# EAGLE schematic S140032_EMS_10HP_DS (EAGLE 6.5.0)

## Sheet 1 of 8: Backplane Layout
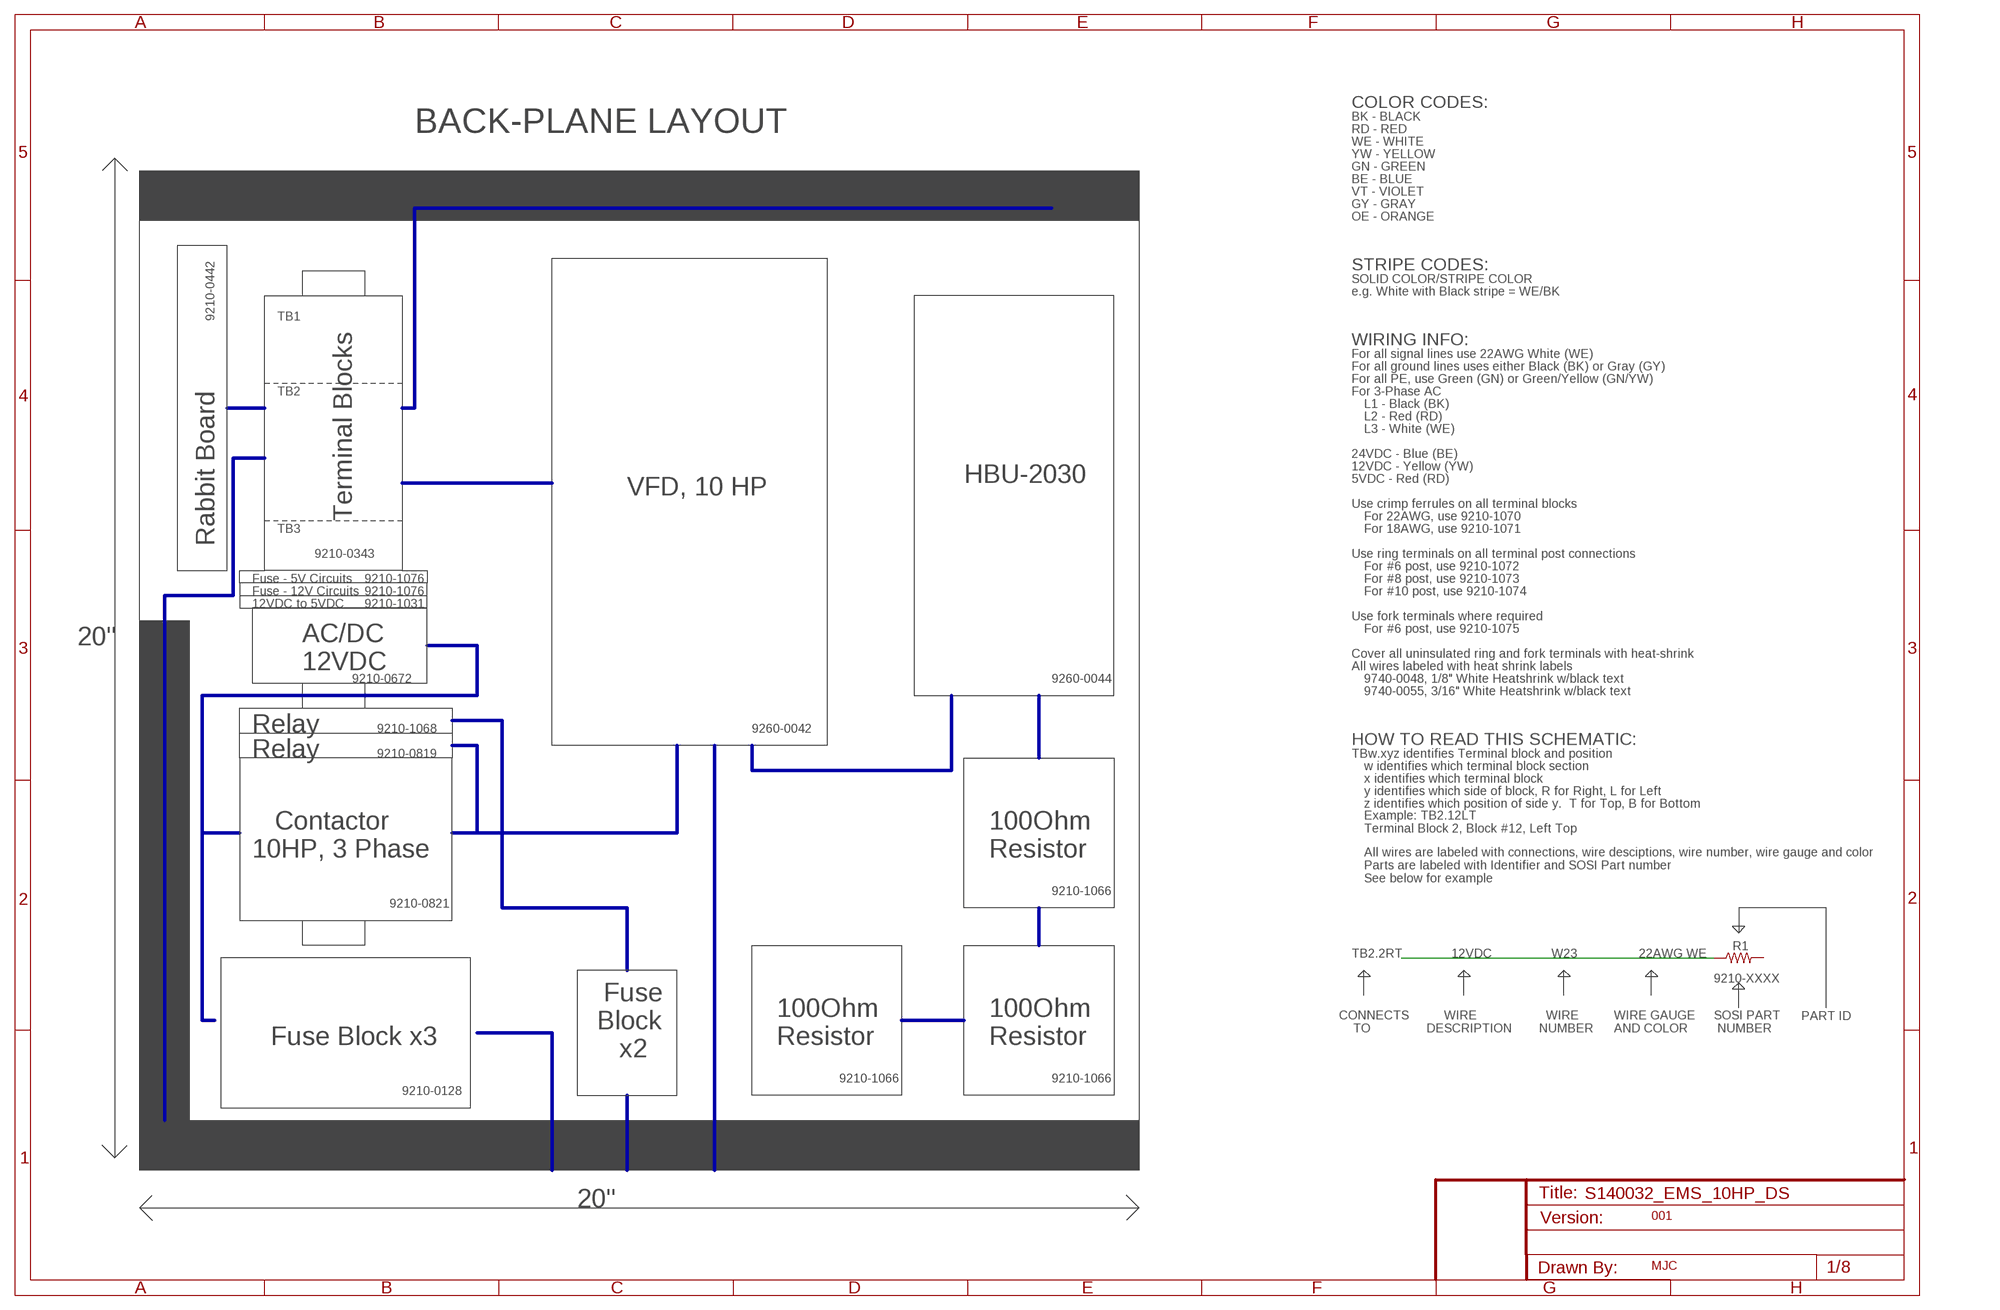
[diagram p0: schematic, sheet 1]

### Parts
R1  R-US_0204/2V  [0204V]

### Nets
12VDC: R1.1 ; also sheet 2,4,6,7,8
Unconnected: R1.2

### Buses
B$1
B$2
B$3
B$4
B$5
B$6
B$7
B$8
B$9
B$10
B$11
B$12
B$13
B$14

### Notes on the sheet
- COLOR CODES:
- BK - BLACK
- BACK-PLANE LAYOUT | RD - RED
- WE - WHITE
- YW - YELLOW
- GN - GREEN
- BE - BLUE
- VT - VIOLET
- GY - GRAY
- OE - ORANGE
- STRIPE CODES:
- SOLID COLOR/STRIPE COLOR
- e.g. White with Black stripe = WE/BK
- 9210-0442 | TB1
- WIRING INFO:
- For all signal lines use 22AWG White (WE)
- For all ground lines uses either Black (BK) or Gray (GY)
- For all PE, use Green (GN) or Green/Yellow (GN/YW)
- TB2 | For 3-Phase AC
- L1 - Black (BK)
- L2 - Red (RD)
- L3 - White (WE)
- 24VDC - Blue (BE)
- 12VDC - Yellow (YW)
- HBU-2030 | 5VDC - Red (RD)
- VFD, 10 HP
- Use crimp ferrules on all terminal blocks
- Terminal Blocks | For 22AWG, use 9210-1070
- TB3 | For 18AWG, use 9210-1071
- Rabbit Board
- 9210-0343 | Use ring terminals on all terminal post connections
- For #6 post, use 9210-1072
- Fuse - 5V Circuits | 9210-1076 | For #8 post, use 9210-1073
- Fuse - 12V Circuits | 9210-1076 | For #10 post, use 9210-1074
- 12VDC to 5VDC | 9210-1031
- Use fork terminals where required
- For #6 post, use 9210-1075
- 20"
- Cover all uninsulated ring and fork terminals with heat-shrink
- AC/DC 
  12VDC
- All wires labeled with heat shrink labels
- 9210-0672 | 9260-0044 | 9740-0048, 1/8" White Heatshrink w/black text
- 9740-0055, 3/16" White Heatshrink w/black text
- Relay | 9210-1068 | 9260-0042
- HOW TO READ THIS SCHEMATIC:
- Relay | 9210-0819 | TBw.xyz identifies Terminal block and position
- w identifies which terminal block section
- x identifies which terminal block
- y identifies which side of block, R for Right, L for Left
- z identifies which position of side y.  T for Top, B for Bottom
- Example: TB2.12LT
  Terminal Block 2, Block #12, Left Top
- Contactor
  10HP, 3 Phase
- 100Ohm
  Resistor
- All wires are labeled with connections, wire desciptions, wire number, wire gauge and color
  Parts are labeled with Identifier and SOSI Part number
  See below for example
- 9210-1066
- 9210-0821
- TB2.2RT | W23 | 22AWG WE
- 9210-XXXX
- PART ID
- CONNECTS
      TO
- WIRE 
  DESCRIPTION
- WIRE 
  NUMBER
- WIRE GAUGE
  AND COLOR
- SOSI PART
   NUMBER
- Fuse Block x3
- 100Ohm
  Resistor
- 100Ohm
  Resistor
- Fuse
  Block 
  x2
- 9210-1066 | 9210-1066
- 9210-0128
- 20"
- 001
- MJC

## Sheet 2 of 8: Terminal Blocks
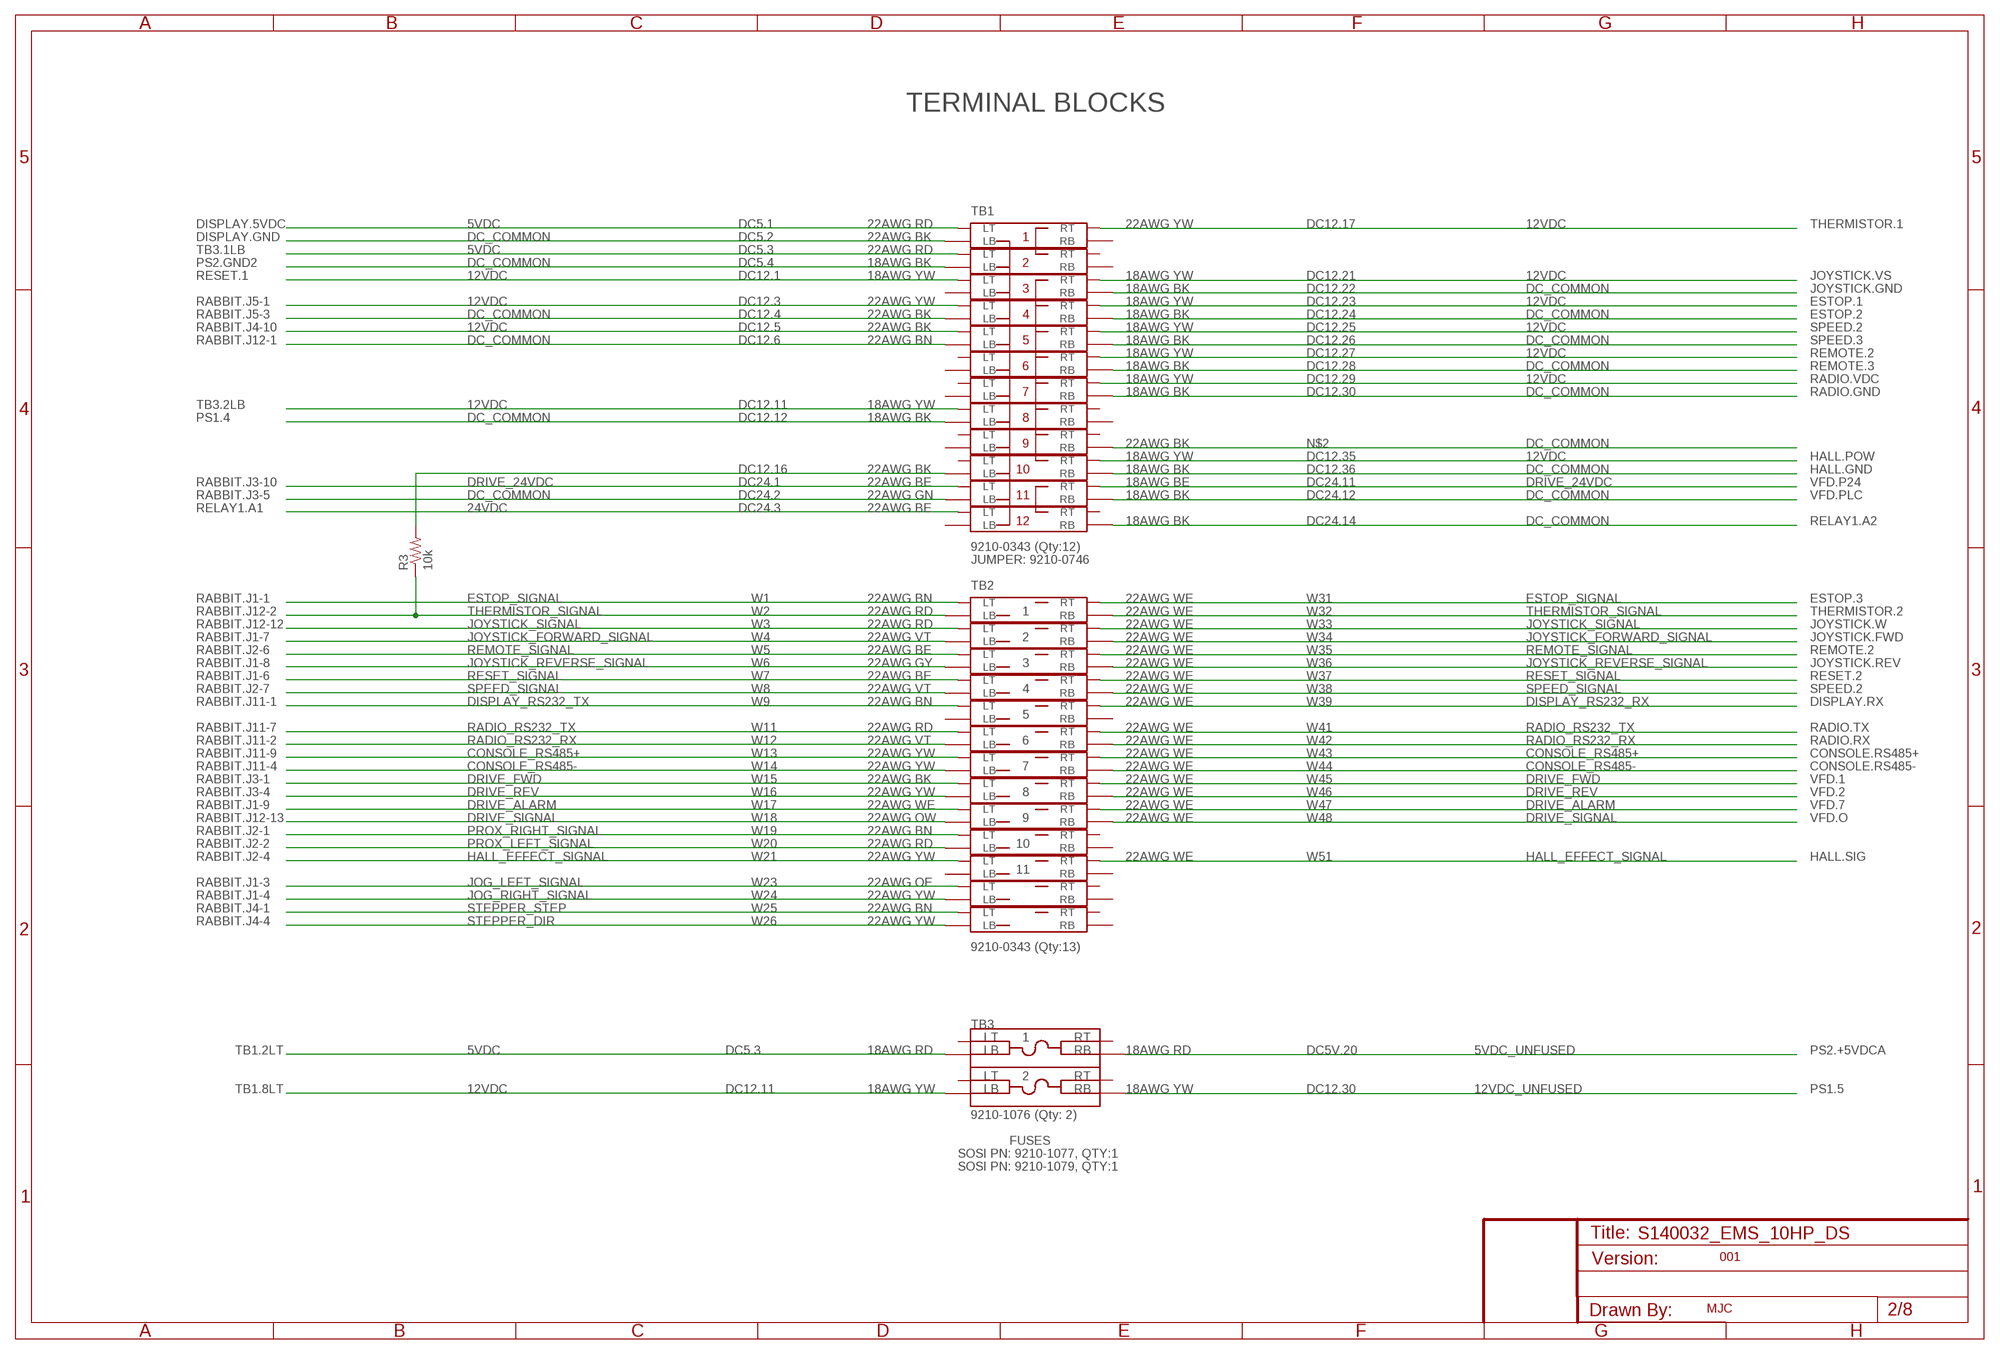
[diagram p1: schematic, sheet 2]

### Parts
R3  10k  R-US_0204/2V  [0204V]
U$1  TB_3031160_1POS  [BOGUS]
U$2  TB_3031160_1POS  [BOGUS]
U$4  TB_3031160_1POS  [BOGUS]
U$7  TB_3031160_1POS  [BOGUS]
U$8  TB_3031160_1POS  [BOGUS]
U$9  TB_FUSE_DDFL4ULR  [BOGUS]
U$10  TB_FUSE_DDFL4ULR  [BOGUS]
U$16  TB_3031160_1POS  [BOGUS]
U$17  TB_3031160_1POS  [BOGUS]
U$18  TB_3031160_1POS  [BOGUS]
U$19  TB_3031160_1POS  [BOGUS]
U$20  TB_3031160_1POS  [BOGUS]
U$21  TB_3031160_1POS  [BOGUS]
U$22  TB_3031160_1POS  [BOGUS]
U$23  TB_3031160_1POS  [BOGUS]
U$24  TB_3031160_1POS  [BOGUS]
U$25  TB_3031160_1POS  [BOGUS]
U$26  TB_3031160_1POS  [BOGUS]
U$27  TB_3031160_1POS  [BOGUS]
U$28  TB_3031160_1POS  [BOGUS]
U$29  TB_3031160_1POS  [BOGUS]
U$30  TB_3031160_1POS  [BOGUS]
U$31  TB_3031160_1POS  [BOGUS]
U$32  TB_3031160_1POS  [BOGUS]
U$33  TB_3031160_1POS  [BOGUS]
U$34  TB_3031160_1POS  [BOGUS]
U$35  TB_3031160_1POS  [BOGUS]

### Nets
5VDC: U$9.P$2 U$34.P$2(LT) U$35.P$2(LT) ; also sheet 7
5VDC_UNFUSED: U$9.P$4 ; also sheet 3
12VDC: U$8.P$4(RT) U$10.P$2 U$28.P$2(LT) U$29.P$4(RT) U$30.P$4(RT) U$31.P$2(LT) U$31.P$4(RT) U$32.P$2(LT) U$32.P$4(RT) U$33.P$2(LT) U$33.P$4(RT) U$35.P$4(RT) ; also sheet 1,4,6,7,8
12VDC_UNFUSED: U$10.P$4 ; also sheet 3
24VDC: U$26.P$2(LT)
CONSOLE_RS485+: U$21.P$2(LT) U$21.P$4(RT) ; also sheet 4,7
CONSOLE_RS485-: U$21.P$1(LB) U$21.P$3(RB) ; also sheet 4,7
DC_COMMON: U$8.P$3(RB) U$26.P$3(RB) U$27.P$1(LB) U$27.P$3(RB) U$28.P$1(LB) U$29.P$3(RB) U$30.P$3(RB) U$31.P$1(LB) U$31.P$3(RB) U$32.P$1(LB) U$32.P$3(RB) U$33.P$3(RB) U$34.P$1(LB) U$35.P$1(LB) ; also sheet 3,4,5,6,7,8
DISPLAY_RS232_RX: U$19.P$4(RT) ; also sheet 7
DISPLAY_RS232_TX: U$19.P$2(LT) ; also sheet 4
DRIVE_24VDC: U$27.P$2(LT) U$27.P$4(RT) ; also sheet 4,5
DRIVE_ALARM: U$23.P$2(LT) U$23.P$4(RT) ; also sheet 4,5
DRIVE_FWD: U$22.P$2(LT) U$22.P$4(RT) ; also sheet 4,5
DRIVE_REV: U$22.P$1(LB) U$22.P$3(RB) ; also sheet 4,5
DRIVE_SIGNAL: U$23.P$1(LB) U$23.P$3(RB) ; also sheet 4,5
ESTOP_SIGNAL: U$4.P$2(LT) U$4.P$4(RT) ; also sheet 3,4,7
HALL_EFFECT_SIGNAL: U$25.P$2(LT) U$25.P$4(RT) ; also sheet 4,8
JOG_LEFT_SIGNAL: U$1.P$2(LT) ; also sheet 4
JOG_RIGHT_SIGNAL: U$1.P$1(LB) ; also sheet 4
JOYSTICK_FORWARD_SIGNAL: U$16.P$1(LB) U$16.P$3(RB) ; also sheet 4,7
JOYSTICK_REVERSE_SIGNAL: U$17.P$1(LB) U$17.P$3(RB) ; also sheet 4,7
JOYSTICK_SIGNAL: U$16.P$2(LT) U$16.P$4(RT) ; also sheet 4,7
N$2: U$7.P$3(RB)
N$5: R3.2 U$8.P$1(LB)
PROX_LEFT_SIGNAL: U$24.P$1(LB) ; also sheet 4
PROX_RIGHT_SIGNAL: U$24.P$2(LT) ; also sheet 4
RADIO_RS232_RX: U$20.P$1(LB) U$20.P$3(RB) ; also sheet 4,7
RADIO_RS232_TX: U$20.P$2(LT) U$20.P$4(RT) ; also sheet 4,7
REMOTE_SIGNAL: U$17.P$2(LT) U$17.P$4(RT) ; also sheet 4,7
RESET_SIGNAL: U$18.P$2(LT) U$18.P$4(RT) ; also sheet 4,7
SPEED_SIGNAL: U$18.P$1(LB) U$18.P$3(RB) ; also sheet 4,7
STEPPER_DIR: U$2.P$1(LB) ; also sheet 4
STEPPER_STEP: U$2.P$2(LT) ; also sheet 4
THERMISTOR_SIGNAL: R3.1 U$4.P$1(LB) U$4.P$3(RB) ; also sheet 4,6
Unconnected: U$1.P$3(RB) U$1.P$4(RT) U$2.P$3(RB) U$2.P$4(RT) U$7.P$1(LB) U$7.P$2(LT) U$7.P$4(RT) U$8.P$2(LT) U$9.P$1 U$9.P$3 U$10.P$1 U$10.P$3 U$19.P$1(LB) U$19.P$3(RB) U$24.P$3(RB) U$24.P$4(RT) U$25.P$1(LB) U$25.P$3(RB) U$26.P$1(LB) U$26.P$4(RT) U$28.P$3(RB) U$28.P$4(RT) U$29.P$1(LB) U$29.P$2(LT) U$30.P$1(LB) U$30.P$2(LT) U$33.P$1(LB) U$34.P$3(RB) U$34.P$4(RT) U$35.P$3(RB)

### Notes on the sheet
- TERMINAL BLOCKS
- TB1
- DISPLAY.5VDC | DC5.1 | 22AWG RD | 22AWG YW | DC12.17 | THERMISTOR.1
- DISPLAY.GND | DC5.2 | 22AWG BK | 1
- TB3.1LB | DC5.3 | 22AWG RD
- PS2.GND2 | DC5.4 | 18AWG BK | 2
- RESET.1 | DC12.1 | 18AWG YW | 18AWG YW | DC12.21 | JOYSTICK.VS
- 3 | 18AWG BK | DC12.22 | JOYSTICK.GND
- RABBIT.J5-1 | DC12.3 | 22AWG YW | 18AWG YW | DC12.23 | ESTOP.1
- RABBIT.J5-3 | DC12.4 | 22AWG BK | 4 | 18AWG BK | DC12.24 | ESTOP.2
- RABBIT.J4-10 | DC12.5 | 22AWG BK | 18AWG YW | DC12.25 | SPEED.2
- RABBIT.J12-1 | DC12.6 | 22AWG BN | 5 | 18AWG BK | DC12.26 | SPEED.3
- 18AWG YW | DC12.27 | REMOTE.2
- 6 | 18AWG BK | DC12.28 | REMOTE.3
- 18AWG YW | DC12.29 | RADIO.VDC
- 7 | 18AWG BK | DC12.30 | RADIO.GND
- TB3.2LB | DC12.11 | 18AWG YW
- PS1.4 | DC12.12 | 18AWG BK | 8
- 9 | 22AWG BK | DC_COMMON
- 18AWG YW | DC12.35 | HALL.POW
- DC12.16 | 22AWG BK | 10 | 18AWG BK | DC12.36 | HALL.GND
- RABBIT.J3-10 | DC24.1 | 22AWG BE | 18AWG BE | DC24.11 | VFD.P24
- RABBIT.J3-5 | DC24.2 | 22AWG GN | 11 | 18AWG BK | DC24.12 | VFD.PLC
- RELAY1.A1 | DC24.3 | 22AWG BE
- 12 | 18AWG BK | DC24.14 | RELAY1.A2
- 9210-0343 (Qty:12)
- JUMPER: 9210-0746
- TB2
- RABBIT.J1-1 | W1 | 22AWG BN | 22AWG WE | W31 | ESTOP.3
- RABBIT.J12-2 | W2 | 22AWG RD | 1 | 22AWG WE | W32 | THERMISTOR.2
- RABBIT.J12-12 | W3 | 22AWG RD | 22AWG WE | W33 | JOYSTICK.W
- RABBIT.J1-7 | W4 | 22AWG VT | 2 | 22AWG WE | W34 | JOYSTICK.FWD
- RABBIT.J2-6 | W5 | 22AWG BE | 22AWG WE | W35 | REMOTE.2
- RABBIT.J1-8 | W6 | 22AWG GY | 3 | 22AWG WE | W36 | JOYSTICK.REV
- RABBIT.J1-6 | W7 | 22AWG BE | 22AWG WE | W37 | RESET.2
- RABBIT.J2-7 | W8 | 22AWG VT | 4 | 22AWG WE | W38 | SPEED.2
- RABBIT.J11-1 | W9 | 22AWG BN | 22AWG WE | W39 | DISPLAY.RX
- 5
- RABBIT.J11-7 | W11 | 22AWG RD | 22AWG WE | W41 | RADIO.TX
- RABBIT.J11-2 | W12 | 22AWG VT | 6 | 22AWG WE | W42 | RADIO.RX
- RABBIT.J11-9 | W13 | 22AWG YW | 22AWG WE | W43 | CONSOLE.RS485+
- RABBIT.J11-4 | W14 | 22AWG YW | 7 | 22AWG WE | W44 | CONSOLE.RS485-
- RABBIT.J3-1 | W15 | 22AWG BK | 22AWG WE | W45 | VFD.1
- RABBIT.J3-4 | W16 | 22AWG YW | 8 | 22AWG WE | W46 | VFD.2
- RABBIT.J1-9 | W17 | 22AWG WE | 22AWG WE | W47 | VFD.7
- RABBIT.J12-13 | W18 | 22AWG OW | 9 | 22AWG WE | W48 | VFD.O
- RABBIT.J2-1 | W19 | 22AWG BN
- RABBIT.J2-2 | W20 | 22AWG RD | 10
- RABBIT.J2-4 | W21 | 22AWG YW | 22AWG WE | W51 | HALL.SIG
- 11
- RABBIT.J1-3 | W23 | 22AWG OE
- RABBIT.J1-4 | W24 | 22AWG YW
- RABBIT.J4-1 | W25 | 22AWG BN
- RABBIT.J4-4 | W26 | 22AWG YW
- 9210-0343 (Qty:13)
- TB3
- 1
- TB1.2LT | DC5.3 | 18AWG RD | 18AWG RD | DC5V.20 | PS2.+5VDCA
- 2
- TB1.8LT | DC12.11 | 18AWG YW | 18AWG YW | DC12.30 | PS1.5
- 9210-1076 (Qty: 2)
- FUSES
- SOSI PN: 9210-1077, QTY:1
- SOSI PN: 9210-1079, QTY:1
- 001
- MJC

## Sheet 3 of 8: Power Supplies
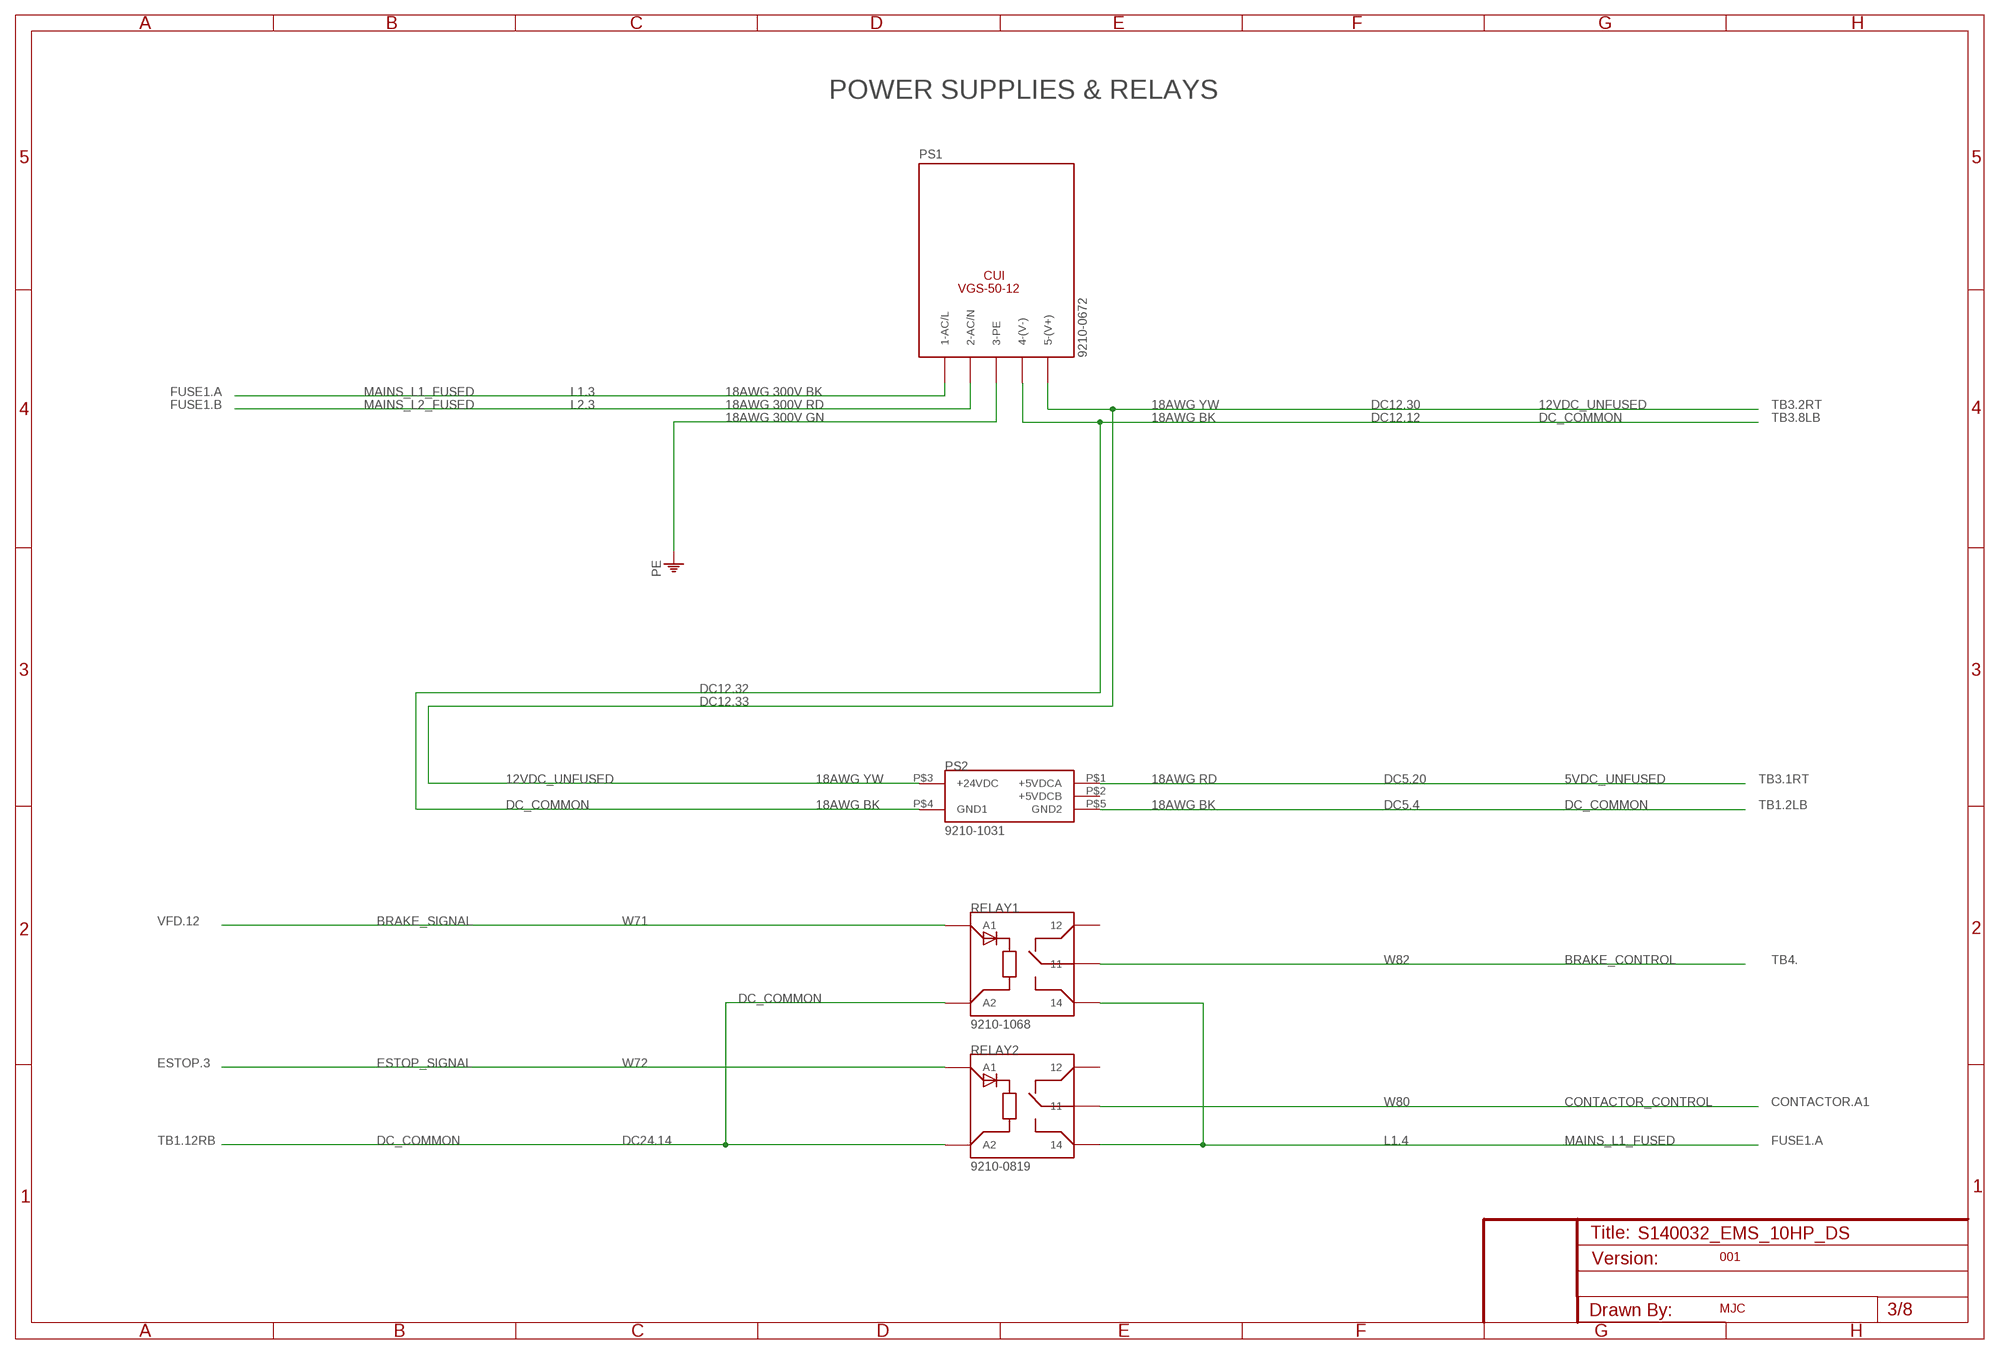
[diagram p2: schematic, sheet 3]

### Parts
PS1  DC-DC_CONVERTER_VGS-50-12  [BOGUS]
PS2  DC-DC_CONVERTER_24V-5V  [BOGUS]
RELAY1  RELAY_TB  [BOGUS]
RELAY2  RELAY_TB  [BOGUS]

### Nets
5VDC_UNFUSED: PS2.P$1(+5VDCA) ; also sheet 2
12VDC_UNFUSED: PS1.P$5(5-(V+)) PS2.P$3(+24VDC) ; also sheet 2
BRAKE_CONTROL: RELAY1.P$1 ; also sheet 6
BRAKE_SIGNAL: RELAY1.P$4(A1) ; also sheet 5
CONTACTOR_CONTROL: RELAY2.P$1 ; also sheet 6
DC_COMMON: PS1.P$4(4-(V-)) PS2.P$4(GND1) PS2.P$5(GND2) RELAY1.P$5(A2) RELAY2.P$5(A2) ; also sheet 2,4,5,6,7,8
ESTOP_SIGNAL: RELAY2.P$4(A1) ; also sheet 2,4,7
MAINS_L1_FUSED: PS1.P$1(1-AC/L) RELAY1.P$3 RELAY2.P$3 ; also sheet 5,6
MAINS_L2_FUSED: PS1.P$2(2-AC/N) ; also sheet 5,6
PE: PS1.P$3(3-PE)
Unconnected: PS2.P$2(+5VDCB) RELAY1.P$2 RELAY2.P$2

### Notes on the sheet
- POWER SUPPLIES & RELAYS
- 9210-0672
- FUSE1.A | L1.3 | 18AWG 300V BK
- FUSE1.B | L2.3 | 18AWG 300V RD | 18AWG YW | DC12.30 | TB3.2RT
- 18AWG 300V GN | 18AWG BK | DC12.12 | TB3.8LB
- DC12.32
- DC12.33
- 18AWG YW | 18AWG RD | DC5.20 | TB3.1RT
- 18AWG BK | 18AWG BK | DC5.4 | TB1.2LB
- 9210-1031
- VFD.12 | W71
- W82 | TB4.
- 9210-1068
- ESTOP.3 | W72
- W80 | CONTACTOR.A1
- TB1.12RB | DC24.14 | L1.4 | FUSE1.A
- 9210-0819
- 001
- MJC

## Sheet 4 of 8: Rabbit Board Wiring
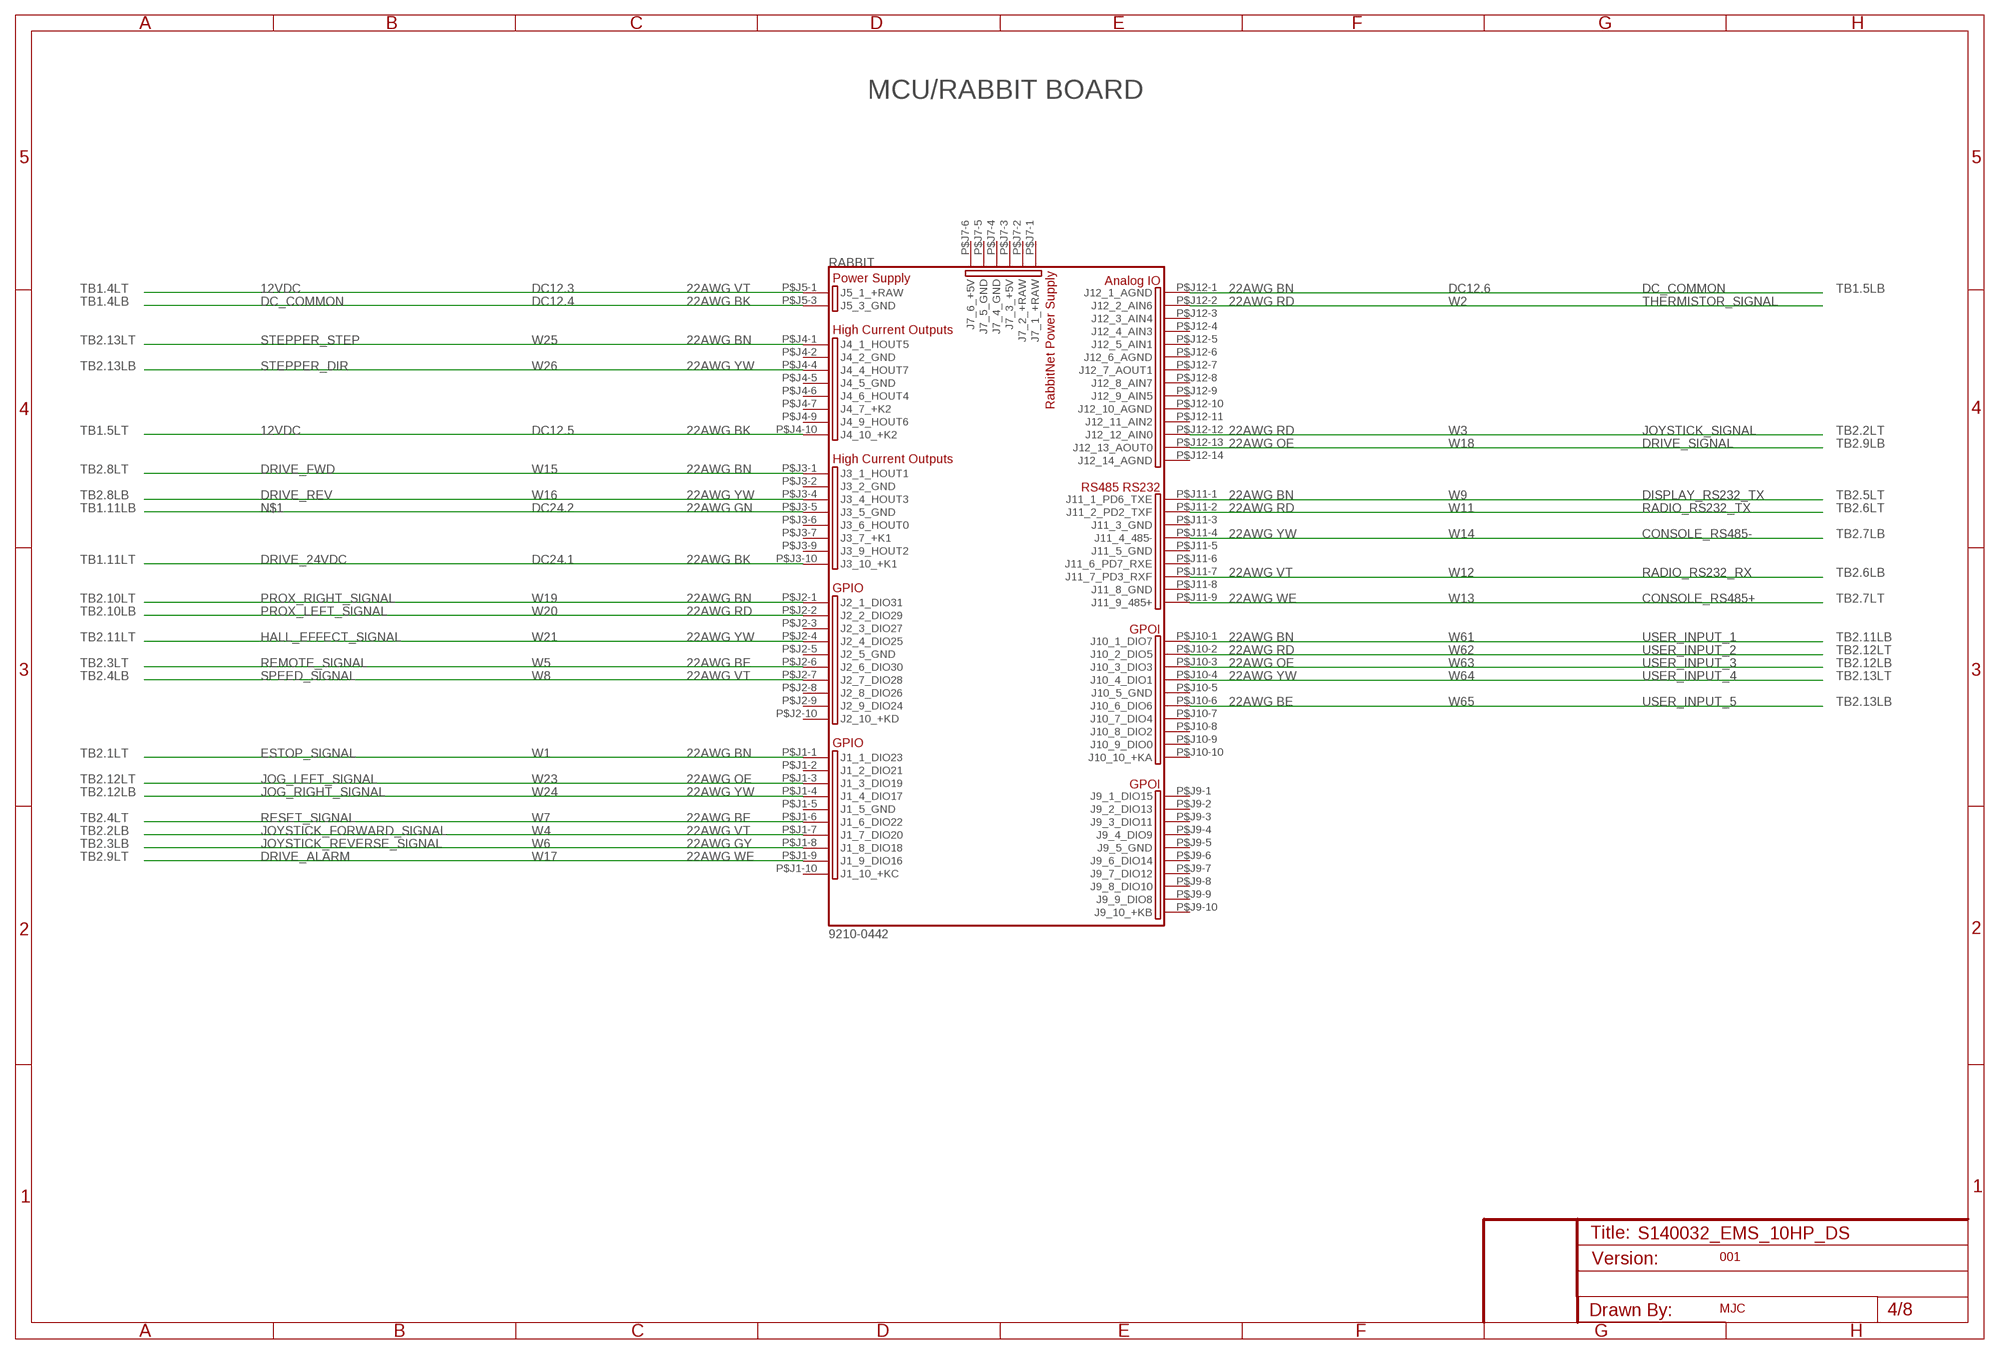
[diagram p3: schematic, sheet 4]

### Parts
CPU1  RABBIT_BL4S200(RCM4310)  [RABBIT_BL4S200]

### Nets
12VDC: CPU1.P$J4-10(J4_10_+K2) CPU1.P$J5-1(J5_1_+RAW) ; also sheet 1,2,6,7,8
CONSOLE_RS485+: CPU1.P$J11-9(J11_9_485+) ; also sheet 2,7
CONSOLE_RS485-: CPU1.P$J11-4(J11_4_485-) ; also sheet 2,7
DC_COMMON: CPU1.P$J5-3(J5_3_GND) CPU1.P$J12-1(J12_1_AGND) ; also sheet 2,3,5,6,7,8
DISPLAY_RS232_TX: CPU1.P$J11-1(J11_1_PD6_TXE) ; also sheet 2
DRIVE_24VDC: CPU1.P$J3-10(J3_10_+K1) ; also sheet 2,5
DRIVE_ALARM: CPU1.P$J1-9(J1_9_DIO16) ; also sheet 2,5
DRIVE_FWD: CPU1.P$J3-1(J3_1_HOUT1) ; also sheet 2,5
DRIVE_REV: CPU1.P$J3-4(J3_4_HOUT3) ; also sheet 2,5
DRIVE_SIGNAL: CPU1.P$J12-13(J12_13_AOUT0) ; also sheet 2,5
ESTOP_SIGNAL: CPU1.P$J1-1(J1_1_DIO23) ; also sheet 2,3,7
HALL_EFFECT_SIGNAL: CPU1.P$J2-4(J2_4_DIO25) ; also sheet 2,8
JOG_LEFT_SIGNAL: CPU1.P$J1-3(J1_3_DIO19) ; also sheet 2
JOG_RIGHT_SIGNAL: CPU1.P$J1-4(J1_4_DIO17) ; also sheet 2
JOYSTICK_FORWARD_SIGNAL: CPU1.P$J1-7(J1_7_DIO20) ; also sheet 2,7
JOYSTICK_REVERSE_SIGNAL: CPU1.P$J1-8(J1_8_DIO18) ; also sheet 2,7
JOYSTICK_SIGNAL: CPU1.P$J12-12(J12_12_AIN0) ; also sheet 2,7
N$1: CPU1.P$J3-5(J3_5_GND)
PROX_LEFT_SIGNAL: CPU1.P$J2-2(J2_2_DIO29) ; also sheet 2
PROX_RIGHT_SIGNAL: CPU1.P$J2-1(J2_1_DIO31) ; also sheet 2
RADIO_RS232_RX: CPU1.P$J11-7(J11_7_PD3_RXF) ; also sheet 2,7
RADIO_RS232_TX: CPU1.P$J11-2(J11_2_PD2_TXF) ; also sheet 2,7
REMOTE_SIGNAL: CPU1.P$J2-6(J2_6_DIO30) ; also sheet 2,7
RESET_SIGNAL: CPU1.P$J1-6(J1_6_DIO22) ; also sheet 2,7
SPEED_SIGNAL: CPU1.P$J2-7(J2_7_DIO28) ; also sheet 2,7
STEPPER_DIR: CPU1.P$J4-4(J4_4_HOUT7) ; also sheet 2
STEPPER_STEP: CPU1.P$J4-1(J4_1_HOUT5) ; also sheet 2
THERMISTOR_SIGNAL: CPU1.P$J12-2(J12_2_AIN6) ; also sheet 2,6
USER_INPUT_1: CPU1.P$J10-1(J10_1_DIO7)
USER_INPUT_2: CPU1.P$J10-2(J10_2_DIO5)
USER_INPUT_3: CPU1.P$J10-3(J10_3_DIO3)
USER_INPUT_4: CPU1.P$J10-4(J10_4_DIO1)
USER_INPUT_5: CPU1.P$J10-6(J10_6_DIO6)
Unconnected: CPU1.P$J1-2(J1_2_DIO21) CPU1.P$J1-5(J1_5_GND) CPU1.P$J1-10(J1_10_+KC) CPU1.P$J2-3(J2_3_DIO27) CPU1.P$J2-5(J2_5_GND) CPU1.P$J2-8(J2_8_DIO26) CPU1.P$J2-9(J2_9_DIO24) CPU1.P$J2-10(J2_10_+KD) CPU1.P$J3-2(J3_2_GND) CPU1.P$J3-6(J3_6_HOUT0) CPU1.P$J3-7(J3_7_+K1) CPU1.P$J3-9(J3_9_HOUT2) CPU1.P$J4-2(J4_2_GND) CPU1.P$J4-5(J4_5_GND) CPU1.P$J4-6(J4_6_HOUT4) CPU1.P$J4-7(J4_7_+K2) CPU1.P$J4-9(J4_9_HOUT6) CPU1.P$J7-1(J7_1_+RAW) CPU1.P$J7-2(J7_2_+RAW) CPU1.P$J7-3(J7_3_+5V) CPU1.P$J7-4(J7_4_GND) CPU1.P$J7-5(J7_5_GND) CPU1.P$J7-6(J7_6_+5V) CPU1.P$J9-1(J9_1_DIO15) CPU1.P$J9-2(J9_2_DIO13) CPU1.P$J9-3(J9_3_DIO11) CPU1.P$J9-4(J9_4_DIO9) CPU1.P$J9-5(J9_5_GND) CPU1.P$J9-6(J9_6_DIO14) CPU1.P$J9-7(J9_7_DIO12) CPU1.P$J9-8(J9_8_DIO10) CPU1.P$J9-9(J9_9_DIO8) CPU1.P$J9-10(J9_10_+KB) CPU1.P$J10-5(J10_5_GND) CPU1.P$J10-7(J10_7_DIO4) CPU1.P$J10-8(J10_8_DIO2) CPU1.P$J10-9(J10_9_DIO0) CPU1.P$J10-10(J10_10_+KA) CPU1.P$J11-3(J11_3_GND) CPU1.P$J11-5(J11_5_GND) CPU1.P$J11-6(J11_6_PD7_RXE) CPU1.P$J11-8(J11_8_GND) CPU1.P$J12-3(J12_3_AIN4) CPU1.P$J12-4(J12_4_AIN3) CPU1.P$J12-5(J12_5_AIN1) CPU1.P$J12-6(J12_6_AGND) CPU1.P$J12-7(J12_7_AOUT1) CPU1.P$J12-8(J12_8_AIN7) CPU1.P$J12-9(J12_9_AIN5) CPU1.P$J12-10(J12_10_AGND) CPU1.P$J12-11(J12_11_AIN2) CPU1.P$J12-14(J12_14_AGND)

### Notes on the sheet
- MCU/RABBIT BOARD
- RABBIT
- TB1.4LT | DC12.3 | 22AWG VT | 22AWG BN | DC12.6 | TB1.5LB
- TB1.4LB | DC12.4 | 22AWG BK | 22AWG RD | W2
- TB2.13LT | W25 | 22AWG BN
- TB2.13LB | W26 | 22AWG YW
- TB1.5LT | DC12.5 | 22AWG BK | 22AWG RD | W3 | TB2.2LT
- 22AWG OE | W18 | TB2.9LB
- TB2.8LT | W15 | 22AWG BN
- TB2.8LB | W16 | 22AWG YW | 22AWG BN | W9 | TB2.5LT
- TB1.11LB | DC24.2 | 22AWG GN | 22AWG RD | W11 | TB2.6LT
- 22AWG YW | W14 | TB2.7LB
- TB1.11LT | DC24.1 | 22AWG BK
- 22AWG VT | W12 | TB2.6LB
- TB2.10LT | W19 | 22AWG BN | 22AWG WE | W13 | TB2.7LT
- TB2.10LB | W20 | 22AWG RD
- TB2.11LT | W21 | 22AWG YW | 22AWG BN | W61 | TB2.11LB
- 22AWG RD | W62 | TB2.12LT
- TB2.3LT | W5 | 22AWG BE | 22AWG OE | W63 | TB2.12LB
- TB2.4LB | W8 | 22AWG VT | 22AWG YW | W64 | TB2.13LT
- 22AWG BE | W65 | TB2.13LB
- TB2.1LT | W1 | 22AWG BN
- TB2.12LT | W23 | 22AWG OE
- TB2.12LB | W24 | 22AWG YW
- TB2.4LT | W7 | 22AWG BE
- TB2.2LB | W4 | 22AWG VT
- TB2.3LB | W6 | 22AWG GY
- TB2.9LT | W17 | 22AWG WE
- 9210-0442
- 001
- MJC

## Sheet 5 of 8: VFD - Hitachi
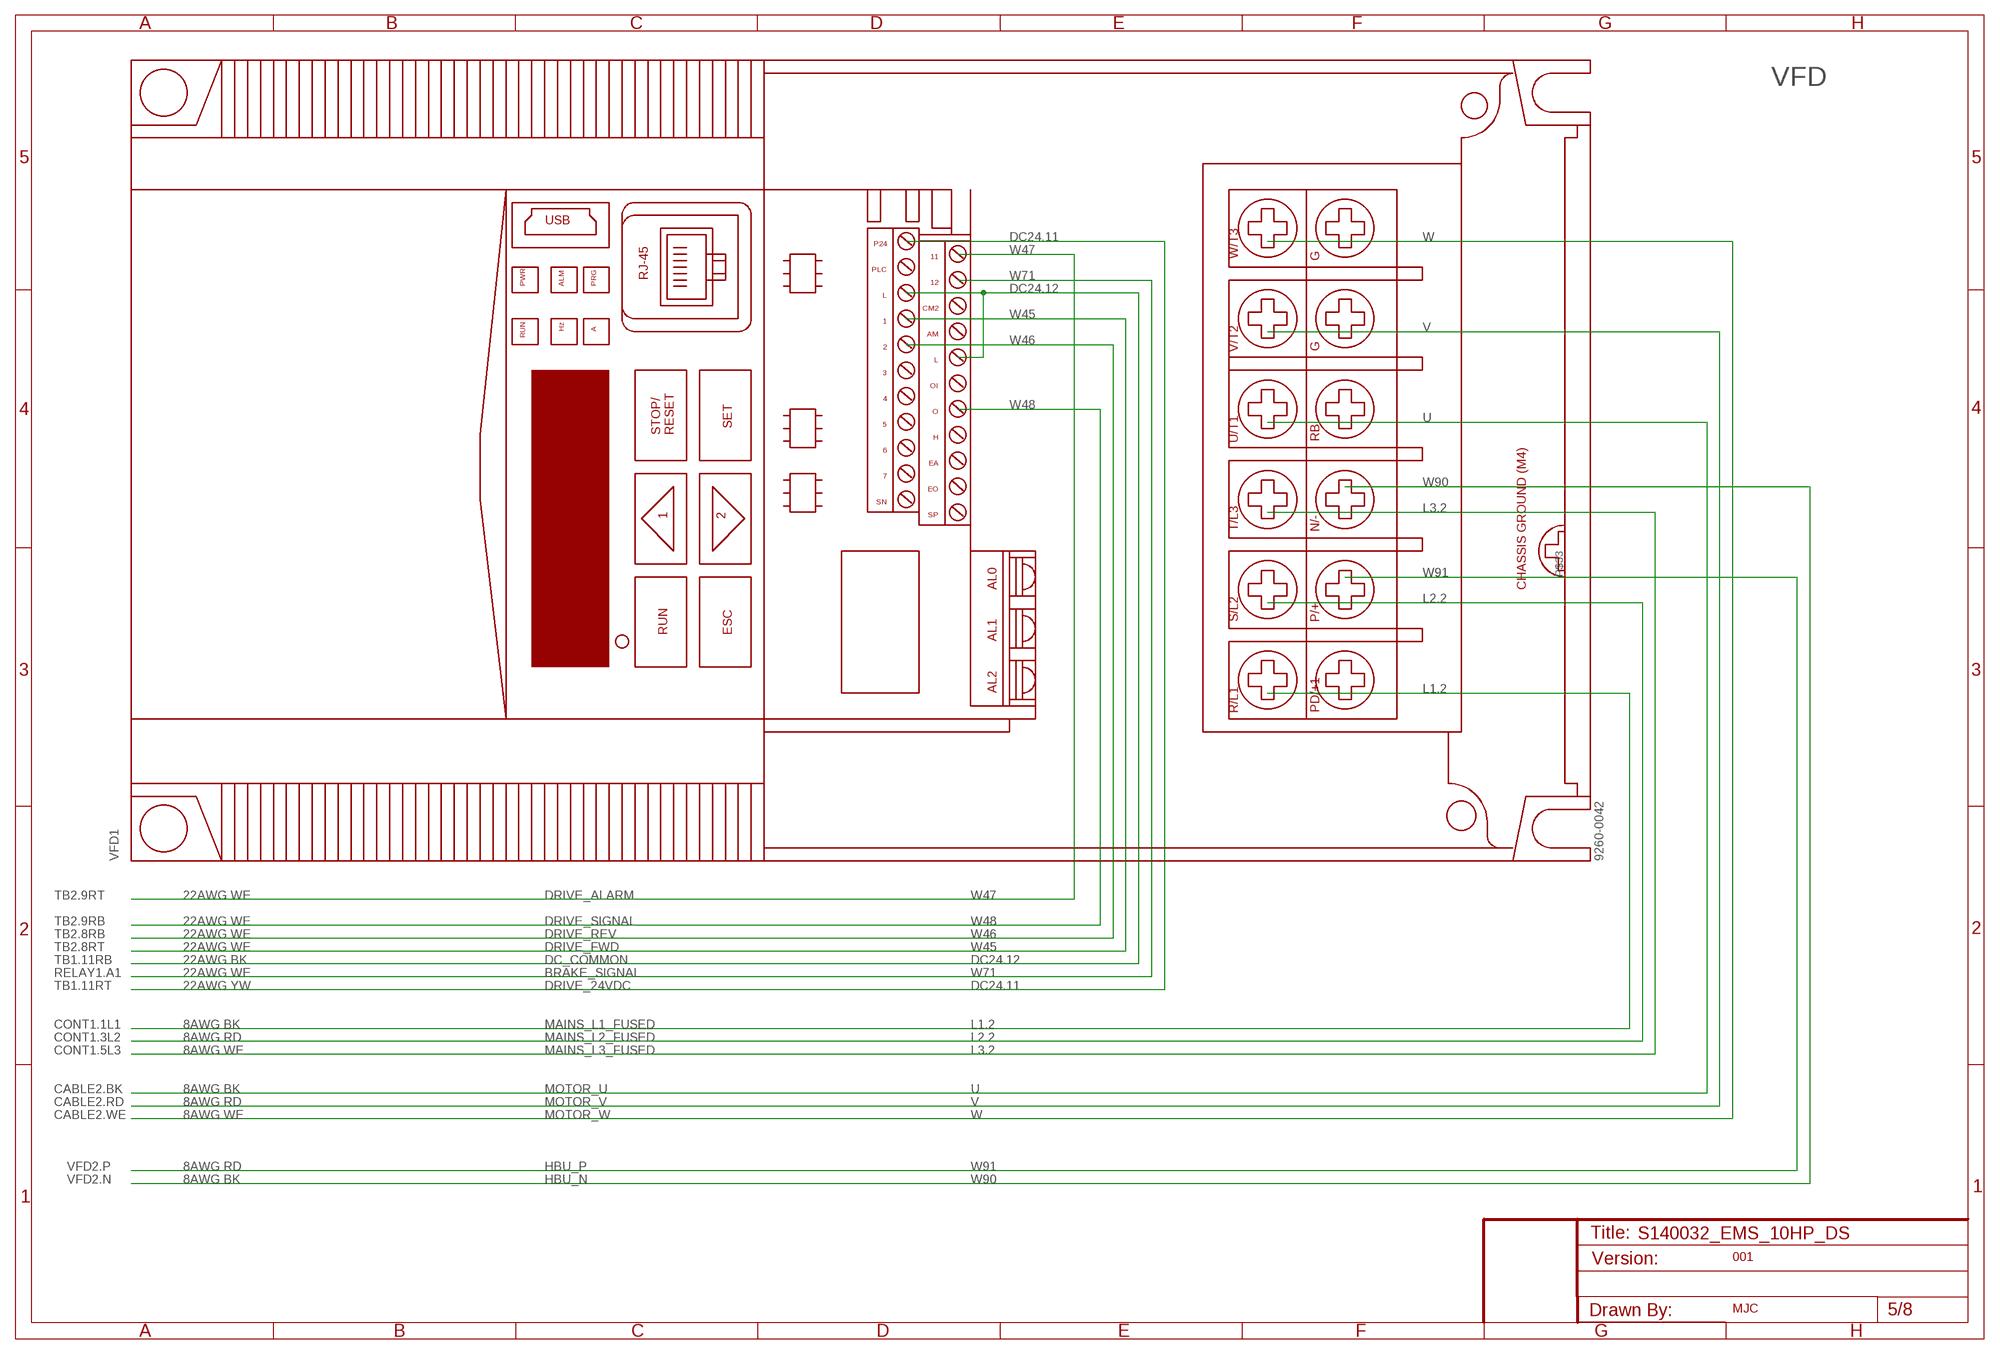
[diagram p4: schematic, sheet 5]

### Parts
VFD1  HITACHI_WJ200-075LF  [BOGUS]

### Nets
BRAKE_SIGNAL: VFD1.P$21 ; also sheet 3
DC_COMMON: VFD1.P$9 VFD1.P$18 ; also sheet 2,3,4,6,7,8
DRIVE_24VDC: VFD1.P$11 ; also sheet 2,4
DRIVE_ALARM: VFD1.P$22 ; also sheet 2,4
DRIVE_FWD: VFD1.P$8 ; also sheet 2,4
DRIVE_REV: VFD1.P$7 ; also sheet 2,4
DRIVE_SIGNAL: VFD1.P$16 ; also sheet 2,4
Unconnected: VFD1.P$1 VFD1.P$2 VFD1.P$3 VFD1.P$4 VFD1.P$5 VFD1.P$6 VFD1.P$10 VFD1.P$12 VFD1.P$13 VFD1.P$14 VFD1.P$15 VFD1.P$17 VFD1.P$19 VFD1.P$20 VFD1.P$23 VFD1.P$24 VFD1.P$25 VFD1.P$26 VFD1.P$27 VFD1.P$28 VFD1.P$29 VFD1.P$30 VFD1.P$31 VFD1.P$32 VFD1.P$33 VFD1.P$34 VFD1.P$35

### Notes on the sheet
- VFD
- DC24.11 | W
- W47
- W71
- DC24.12
- W45
- V
- W46
- W48
- U
- W90
- L3.2
- W91
- L2.2
- L1.2
- 9260-0042
- TB2.9RT | 22AWG WE | W47
- TB2.9RB | 22AWG WE | W48
- TB2.8RB | 22AWG WE | W46
- TB2.8RT | 22AWG WE | W45
- TB1.11RB | 22AWG BK | DC24.12
- RELAY1.A1 | 22AWG WE | W71
- TB1.11RT | 22AWG YW | DC24.11
- CONT1.1L1 | 8AWG BK | L1.2
- CONT1.3L2 | 8AWG RD | L2.2
- CONT1.5L3 | 8AWG WE | L3.2
- CABLE2.BK | 8AWG BK | U
- CABLE2.RD | 8AWG RD | V
- CABLE2.WE | 8AWG WE | W
- VFD2.P | 8AWG RD | W91
- VFD2.N | 8AWG BK | W90
- 001
- MJC

## Sheet 6 of 8: HBU & Dynamic Brake Resistors
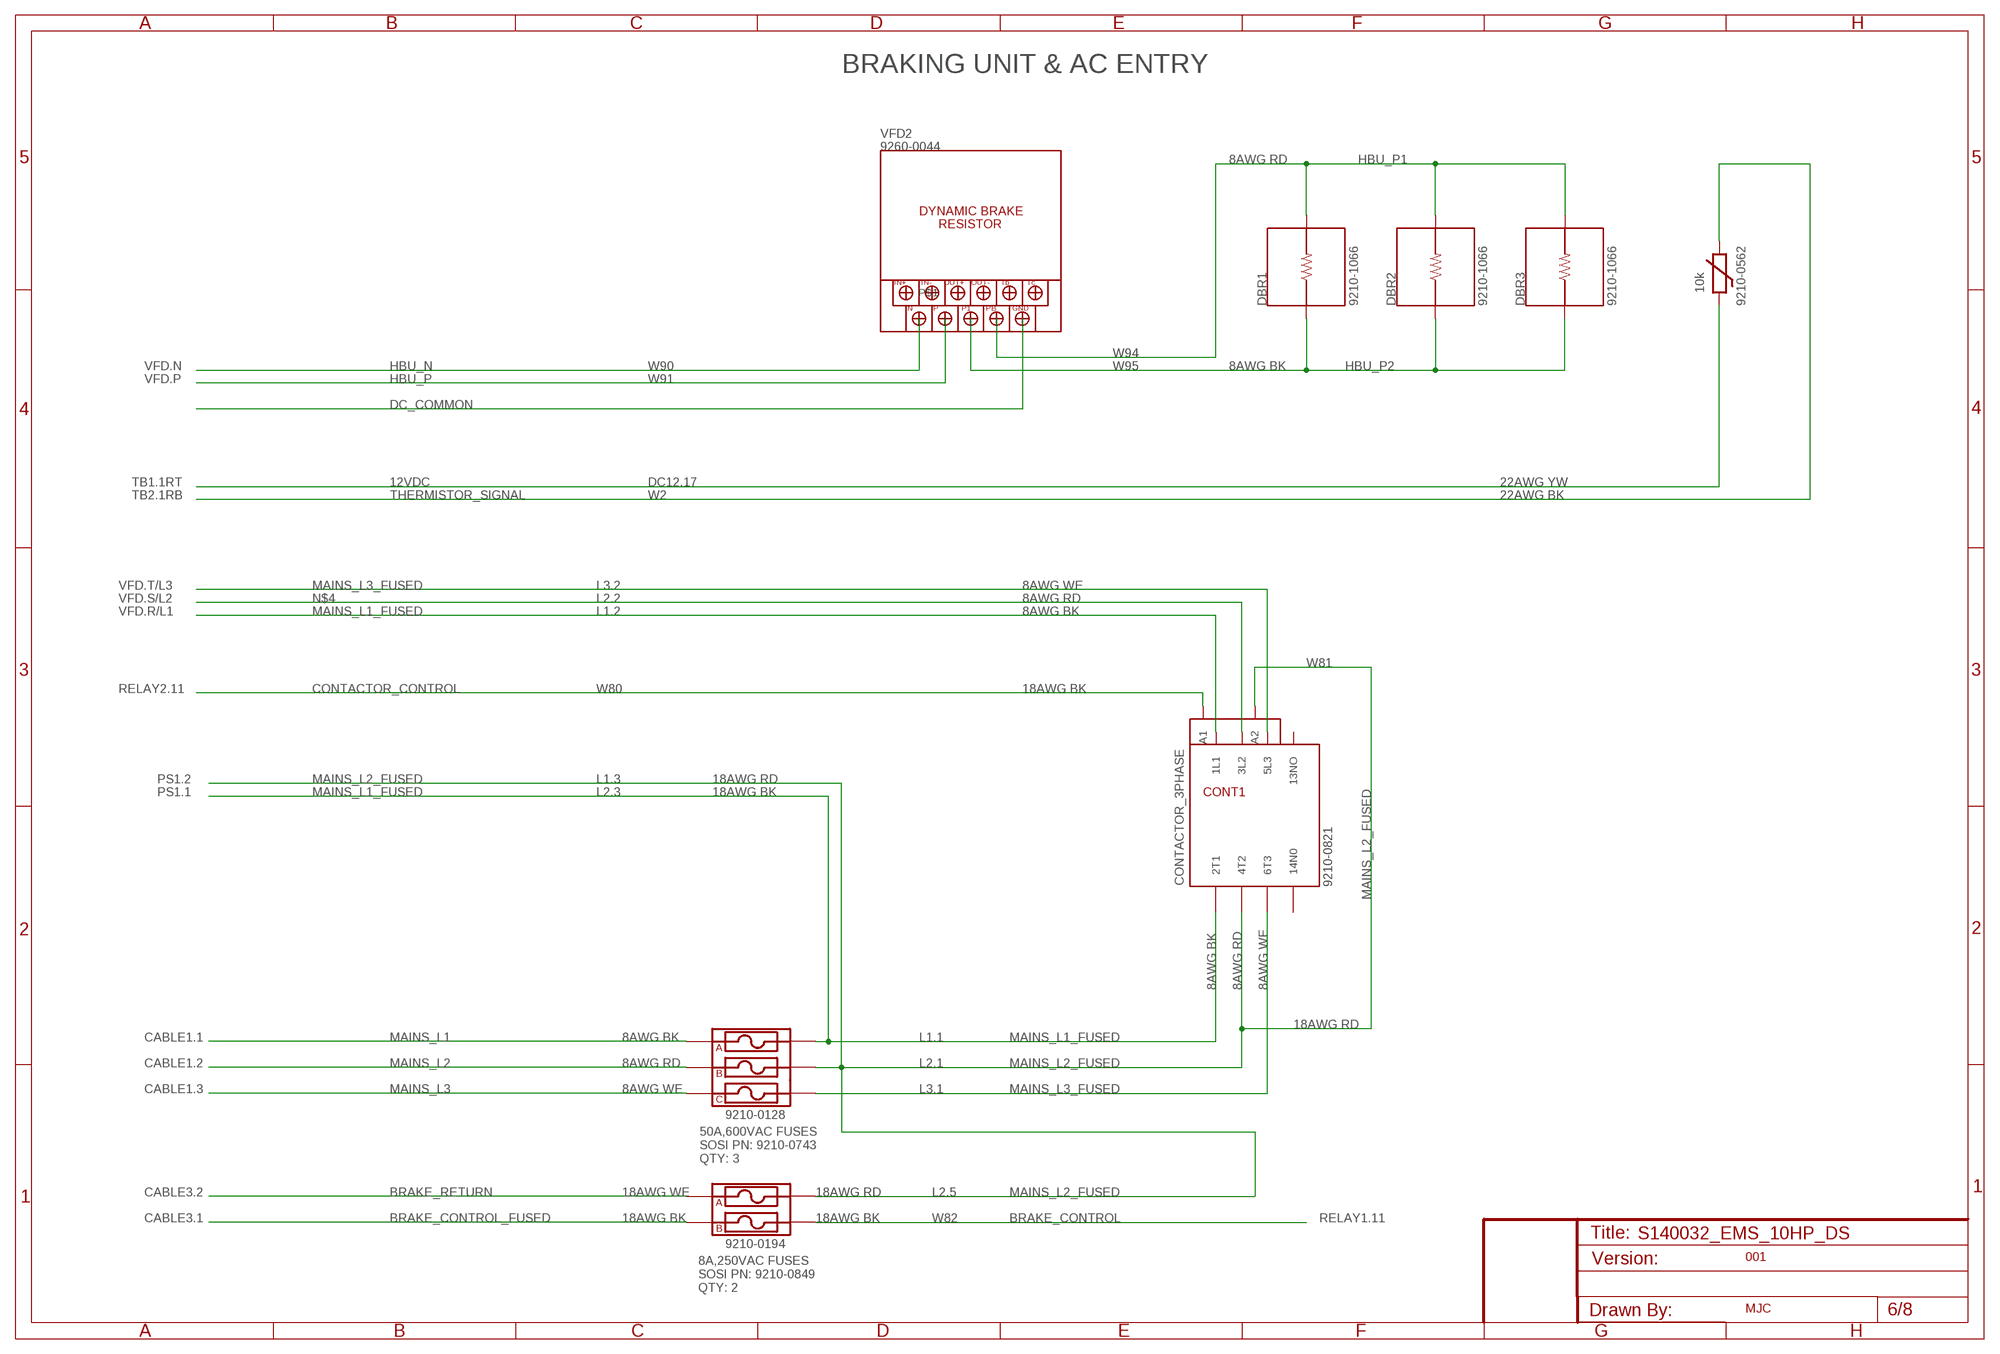
[diagram p5: schematic, sheet 6]

### Parts
CONT1  CONTACTOR_3PHASE  [BOGUS]
DBR1  100 Ohm  R-DYNAMIC_BRAKE  [0204/5]
DBR2  100 Ohm  R-DYNAMIC_BRAKE  [0204/5]
DBR3  100 Ohm  R-DYNAMIC_BRAKE  [0204/5]
FUSE1  FUSE_HOLDER_3-POLE  [BOGUS]
U$5  10k  THERMISTOR  [BOGUS]
U$6  FUSE_HOLDER_2-POLE  [BOGUS]
VFD2  HITACHI_HBU-2030  [BOGUS]

### Nets
12VDC: U$5.P$2 ; also sheet 1,2,4,7,8
BRAKE_CONTROL: U$6.P$4 ; also sheet 3
BRAKE_CONTROL_FUSED: U$6.P$1 ; also sheet 8
BRAKE_RETURN: U$6.P$2 ; also sheet 8
CONTACTOR_CONTROL: CONT1.P$9(A1) ; also sheet 3
DC_COMMON: VFD2.P$7 ; also sheet 2,3,4,5,7,8
HBU_N: VFD2.P$11 ; also sheet 5
HBU_P: VFD2.P$10 ; also sheet 5
HBU_P1: DBR1.2 DBR2.2 DBR3.2 VFD2.P$8
HBU_P2: DBR1.1 DBR2.1 DBR3.1 VFD2.P$9
MAINS_L1: FUSE1.P$2 ; also sheet 8
MAINS_L1_FUSED: CONT1.P$1(1L1) CONT1.P$2(2T1) FUSE1.P$3 ; also sheet 3,5
MAINS_L2: FUSE1.P$1 ; also sheet 8
MAINS_L2_FUSED: CONT1.P$4(4T2) CONT1.P$10(A2) FUSE1.P$4 U$6.P$3 ; also sheet 3,5
MAINS_L3: FUSE1.P$5 ; also sheet 8
MAINS_L3_FUSED: CONT1.P$5(5L3) CONT1.P$6(6T3) FUSE1.P$6 ; also sheet 5
N$4: CONT1.P$3(3L2)
THERMISTOR_SIGNAL: U$5.P$1 ; also sheet 2,4
Unconnected: CONT1.P$7(13NO) CONT1.P$8(14N0) VFD2.P$1 VFD2.P$2 VFD2.P$3 VFD2.P$4 VFD2.P$5 VFD2.P$6

### Notes on the sheet
- BRAKING UNIT & AC ENTRY
- 9260-0044
- 8AWG RD
- 9210-1066 | 9210-1066 | 9210-1066 | 9210-0562
- W94
- VFD.N | W90 | W95 | 8AWG BK
- VFD.P | W91
- TB1.1RT | DC12.17 | 22AWG YW
- TB2.1RB | W2 | 22AWG BK
- VFD.T/L3 | L3.2 | 8AWG WE
- VFD.S/L2 | L2.2 | 8AWG RD
- VFD.R/L1 | L1.2 | 8AWG BK
- W81
- RELAY2.11 | W80 | 18AWG BK
- PS1.2 | L1.3 | 18AWG RD
- PS1.1 | L2.3 | 18AWG BK
- 9210-0821
- 8AWG BK | 8AWG RD | 8AWG WE
- 18AWG RD
- CABLE1.1 | 8AWG BK | L1.1
- CABLE1.2 | 8AWG RD | L2.1
- CABLE1.3 | 8AWG WE | L3.1
- 9210-0128
- 50A,600VAC FUSES
  SOSI PN: 9210-0743
  QTY: 3
- CABLE3.2 | 18AWG WE | 18AWG RD | L2.5
- CABLE3.1 | 18AWG BK | 18AWG BK | W82 | RELAY1.11
- 9210-0194
- 001
- 8A,250VAC FUSES
  SOSI PN: 9210-0849
  QTY: 2
- MJC

## Sheet 7 of 8: Interface Connections
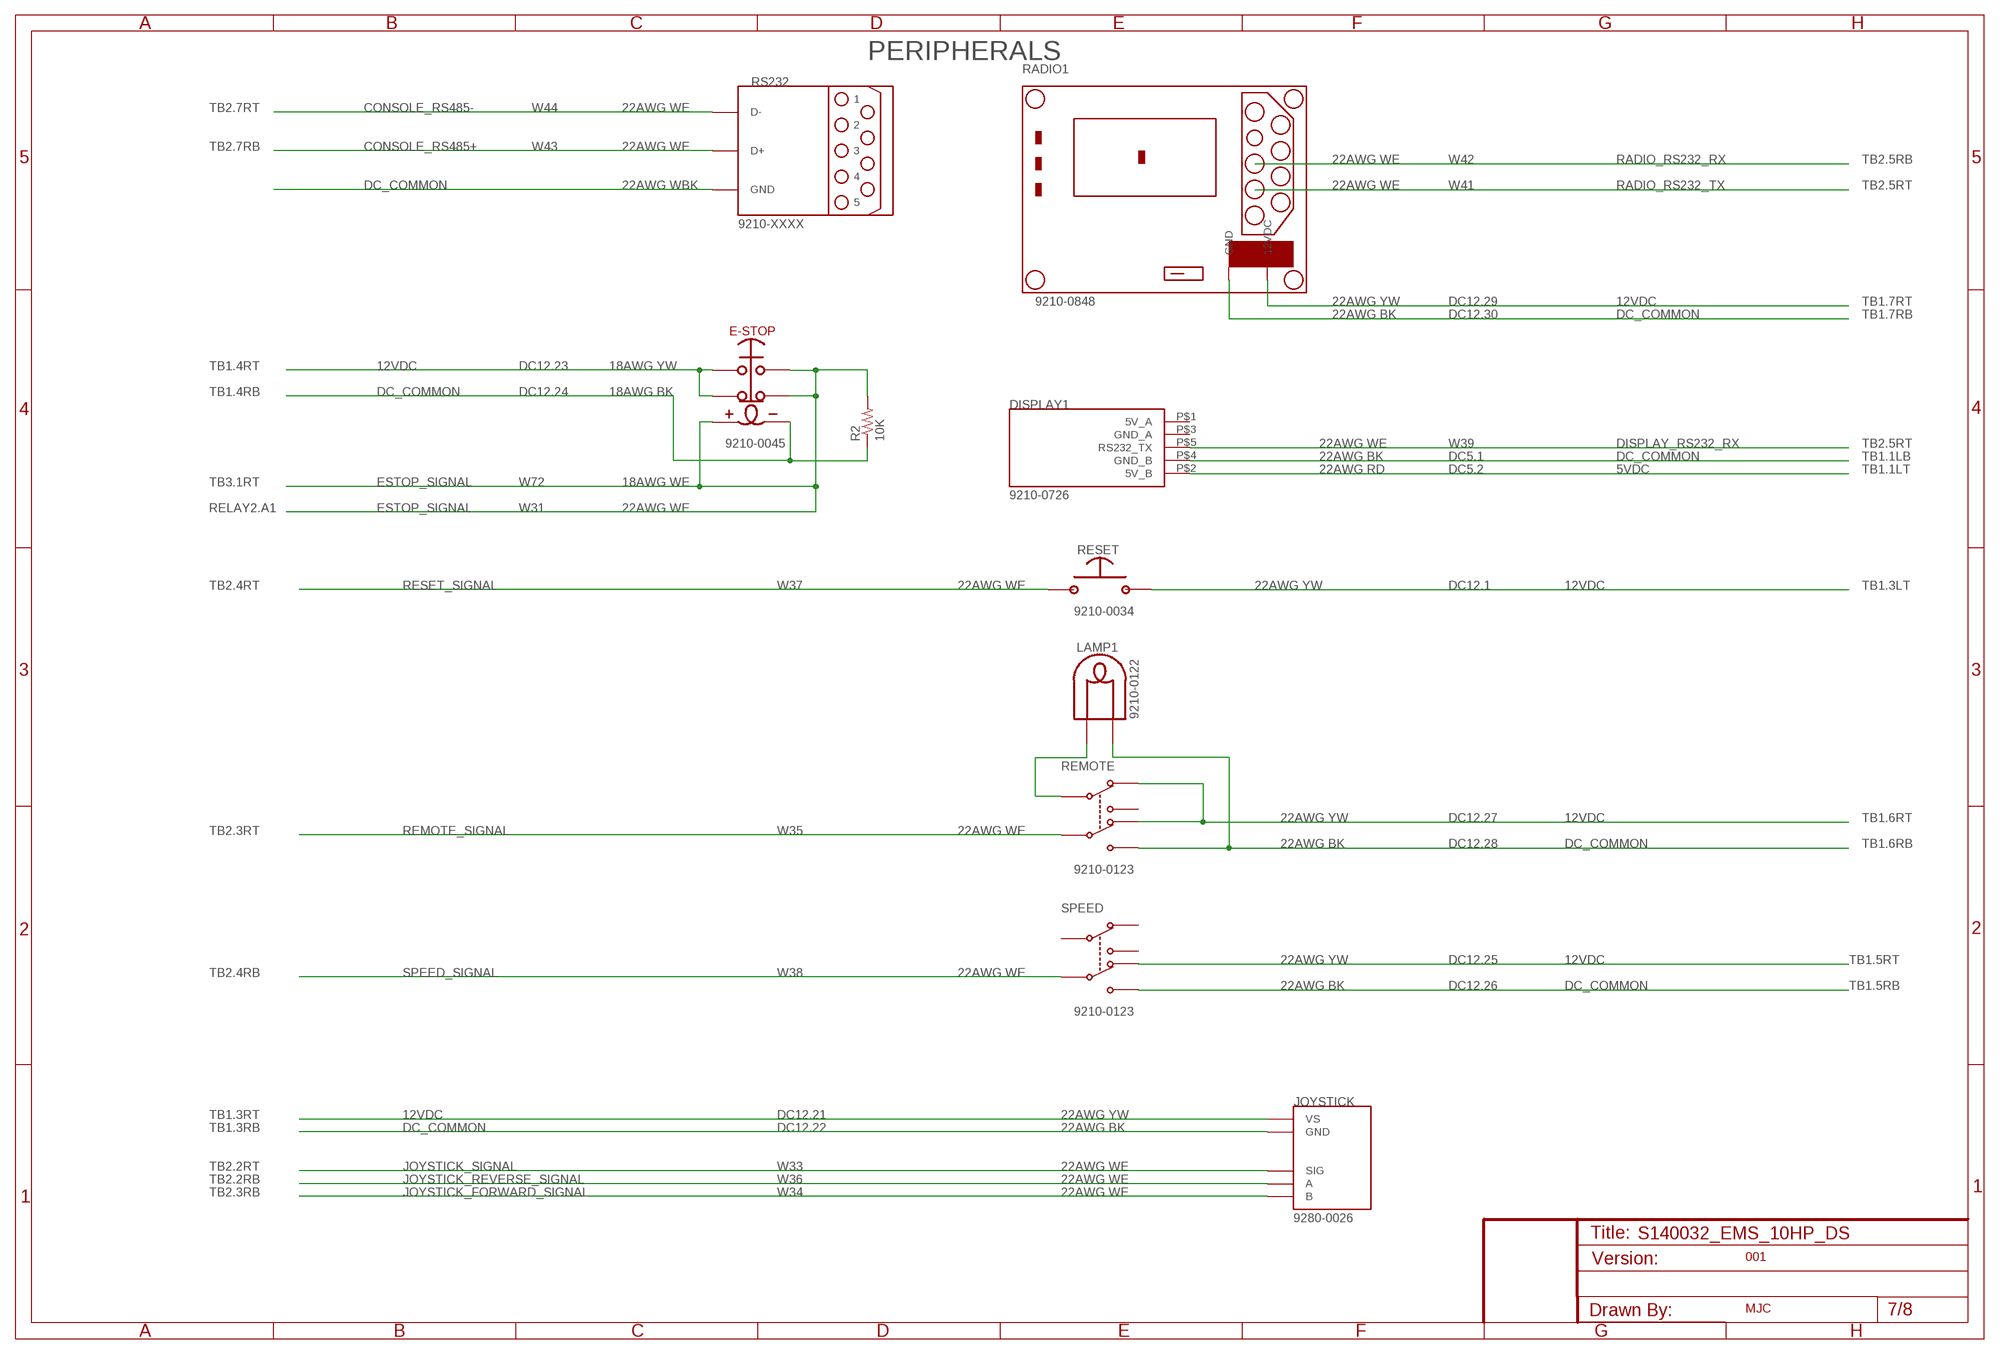
[diagram p6: schematic, sheet 7]

### Parts
DISPLAY1  SEETRON_GLO-416  [BOGUS]
JOYSTICK  JOYSTICK  [BOGUS]
LAMP1  INDICATOR_LIGHT  [BOGUS]
R2  10K  RESISTORAXIAL-0.3  [AXIAL-0.3]
RADIO1  SPARKFUN_XBEE_EXPLORER_SERIAL  [BOGUS]
REMOTE  SWITCH_DPDT  [BOGUS]
RESET  SWITCH_MOM_NO  [BOGUS]
RS232  RS232-RS485_CONVERTER  [BOGUS]
SPEED  SWITCH_DPDT  [BOGUS]
U$3  SWITCH_ESTOP_LIGHTED  [BOGUS]

### Nets
5VDC: DISPLAY1.P$2(5V_B) ; also sheet 2
12VDC: JOYSTICK.P$5(VS) RADIO1.P$52(12VDC) REMOTE.P$2 REMOTE.P$5 RESET.P$2 SPEED.P$5 U$3.P$1 U$3.P$2 ; also sheet 1,2,4,6,8
CONSOLE_RS485+: RS232.P$10(D+) ; also sheet 2,4
CONSOLE_RS485-: RS232.P$11(D-) ; also sheet 2,4
DC_COMMON: DISPLAY1.P$4(GND_B) JOYSTICK.P$3(GND) LAMP1.P$2 R2.P$1 RADIO1.P$53(GND) REMOTE.P$6 RS232.P$12(GND) SPEED.P$6 U$3.P$6 ; also sheet 2,3,4,5,6,8
DISPLAY_RS232_RX: DISPLAY1.P$5(RS232_TX) ; also sheet 2
ESTOP_SIGNAL: R2.P$2 U$3.P$3 U$3.P$4 U$3.P$5 ; also sheet 2,3,4
JOYSTICK_FORWARD_SIGNAL: JOYSTICK.P$2(B) ; also sheet 2,4
JOYSTICK_REVERSE_SIGNAL: JOYSTICK.P$1(A) ; also sheet 2,4
JOYSTICK_SIGNAL: JOYSTICK.P$4(SIG) ; also sheet 2,4
N$32: LAMP1.P$1 REMOTE.P$1
RADIO_RS232_RX: RADIO1.P$3 ; also sheet 2,4
RADIO_RS232_TX: RADIO1.P$2 ; also sheet 2,4
REMOTE_SIGNAL: REMOTE.P$4 ; also sheet 2,4
RESET_SIGNAL: RESET.P$1 ; also sheet 2,4
SPEED_SIGNAL: SPEED.P$4 ; also sheet 2,4
Unconnected: DISPLAY1.P$1(5V_A) DISPLAY1.P$3(GND_A) RADIO1.P$1 RADIO1.P$4 RADIO1.P$5 RADIO1.P$6 RADIO1.P$7 RADIO1.P$8 RADIO1.P$9 RADIO1.P$10 RADIO1.P$11 RADIO1.P$12 RADIO1.P$13 RADIO1.P$14 RADIO1.P$15 RADIO1.P$16 RADIO1.P$17 RADIO1.P$18 RADIO1.P$19 RADIO1.P$20 RADIO1.P$21 RADIO1.P$22 RADIO1.P$23 RADIO1.P$24 RADIO1.P$25 RADIO1.P$26 RADIO1.P$27 RADIO1.P$28 RADIO1.P$29 RADIO1.P$30 RADIO1.P$31 RADIO1.P$32 RADIO1.P$33 RADIO1.P$34 RADIO1.P$35 RADIO1.P$36 RADIO1.P$37 RADIO1.P$38 RADIO1.P$39 RADIO1.P$40 RADIO1.P$41 RADIO1.P$42 RADIO1.P$43 RADIO1.P$44 RADIO1.P$45 RADIO1.P$46 RADIO1.P$47 RADIO1.P$48 RADIO1.P$49 RADIO1.P$50 RADIO1.P$51 REMOTE.P$3 RS232.P$1 RS232.P$2 RS232.P$3 RS232.P$4 RS232.P$5 RS232.P$6 RS232.P$7 RS232.P$8 RS232.P$9 SPEED.P$1 SPEED.P$2 SPEED.P$3

### Notes on the sheet
- PERIPHERALS
- TB2.7RT | W44 | 22AWG WE
- TB2.7RB | W43 | 22AWG WE
- 22AWG WE | W42 | TB2.5RB
- 22AWG WBK | 22AWG WE | W41 | TB2.5RT
- 9210-XXXX
- 9210-0848 | 22AWG YW | DC12.29 | TB1.7RT
- 22AWG BK | DC12.30 | TB1.7RB
- TB1.4RT | DC12.23 | 18AWG YW
- TB1.4RB | DC12.24 | 18AWG BK
- 9210-0045 | 22AWG WE | W39 | TB2.5RT
- 22AWG BK | DC5.1 | TB1.1LB
- 22AWG RD | DC5.2 | TB1.1LT
- TB3.1RT | W72 | 18AWG WE
- 9210-0726
- RELAY2.A1 | W31 | 22AWG WE
- TB2.4RT | W37 | 22AWG WE | 22AWG YW | DC12.1 | TB1.3LT
- 9210-0034
- 9210-0122
- 22AWG YW | DC12.27 | TB1.6RT
- TB2.3RT | W35 | 22AWG WE
- 22AWG BK | DC12.28 | TB1.6RB
- 9210-0123
- 22AWG YW | DC12.25 | TB1.5RT
- TB2.4RB | W38 | 22AWG WE
- 22AWG BK | DC12.26 | TB1.5RB
- 9210-0123
- TB1.3RT | DC12.21 | 22AWG YW
- TB1.3RB | DC12.22 | 22AWG BK
- TB2.2RT | W33 | 22AWG WE
- TB2.2RB | W36 | 22AWG WE
- TB2.3RB | W34 | 22AWG WE
- 9280-0026
- 001
- MJC

## Sheet 8 of 8
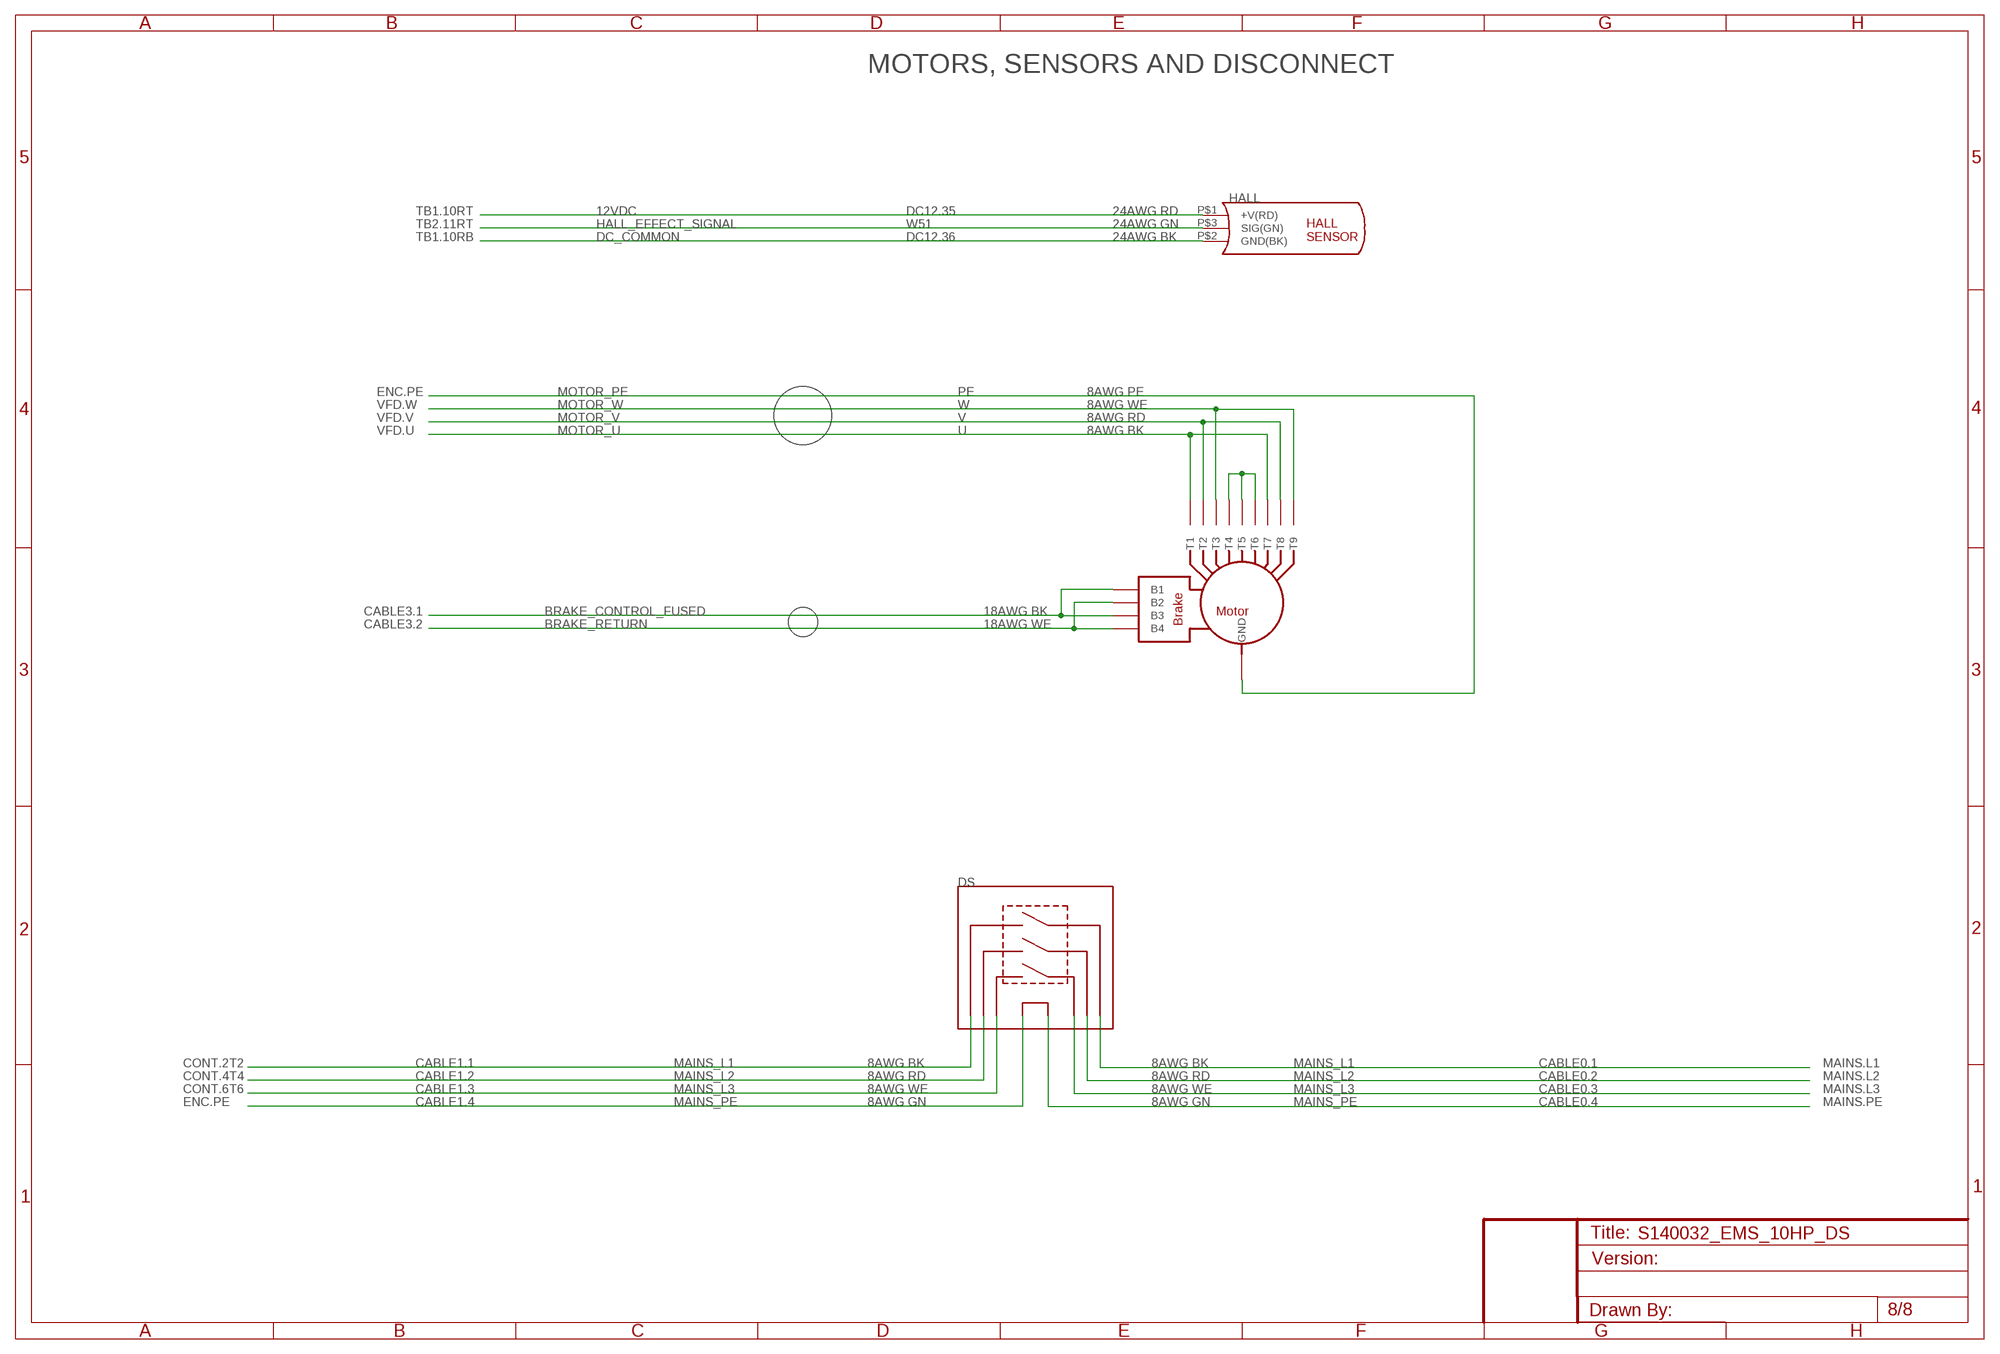
[diagram p7: schematic, sheet 8]

### Parts
DS  DISCONNECT_SWITCH  [BOGUS]
HALL  DRUM_SENSOR  [BOGUS]
U$11  MOTOR_3PH  [BOGUS]

### Nets
12VDC: HALL.P$1(+V(RD)) ; also sheet 1,2,4,6,7
BRAKE_CONTROL_FUSED: U$11.P$1(B1) U$11.P$3(B3) ; also sheet 6
BRAKE_RETURN: U$11.P$2(B2) U$11.P$4(B4) ; also sheet 6
DC_COMMON: HALL.P$2(GND(BK)) ; also sheet 2,3,4,5,6,7
HALL_EFFECT_SIGNAL: HALL.P$3(SIG(GN)) ; also sheet 2,4
MAINS_L1: DS.P$3 DS.P$4 ; also sheet 6
MAINS_L2: DS.P$2 DS.P$5 ; also sheet 6
MAINS_L3: DS.P$1 DS.P$6 ; also sheet 6
MAINS_PE: DS.P$7 DS.P$8
MOTOR_PE: U$11.P$14(GND)
MOTOR_U: U$11.P$5(T1) U$11.P$11(T7) ; also sheet 5
MOTOR_V: U$11.P$6(T2) U$11.P$12(T8) ; also sheet 5
MOTOR_W: U$11.P$7(T3) U$11.P$13(T9) ; also sheet 5
N$3: U$11.P$8(T4) U$11.P$9(T5) U$11.P$10(T6)

### Notes on the sheet
- MOTORS, SENSORS AND DISCONNECT
- TB1.10RT | DC12.35 | 24AWG RD
- TB2.11RT | W51 | 24AWG GN
- TB1.10RB | DC12.36 | 24AWG BK
- ENC.PE | PE | 8AWG PE
- VFD.W | W | 8AWG WE
- VFD.V | V | 8AWG RD
- VFD.U | U | 8AWG BK
- CABLE3.1 | 18AWG BK
- CABLE3.2 | 18AWG WE
- CONT.2T2 | CABLE1.1 | 8AWG BK | 8AWG BK | CABLE0.1 | MAINS.L1
- CONT.4T4 | CABLE1.2 | 8AWG RD | 8AWG RD | CABLE0.2 | MAINS.L2
- CONT.6T6 | CABLE1.3 | 8AWG WE | 8AWG WE | CABLE0.3 | MAINS.L3
- ENC.PE | CABLE1.4 | 8AWG GN | 8AWG GN | CABLE0.4 | MAINS.PE

## Library data of the parts
CONT1 = SOSI-Wiring-Diagram.rpt:CONTACTOR_3PHASE
CPU1 = DougM.SOSI.Microcontroller:RABBIT_BL4S200(RCM4310): 9210-0442 COMPUTER SINGLE-BOARD BL4S200 Rabbit Semiconductor 20-101-1220 Digi-Key 316-1164-ND
DBR1-DBR3 = resistor:R-DYNAMIC_BRAKE
DISPLAY1 = DougM-SOSI-Wiring-Diagram.rpt:SEETRON_GLO-416
DS = SOSI-Wiring-Diagram.rpt:DISCONNECT_SWITCH
FUSE1 = SOSI-Wiring-Diagram.rpt:FUSE_HOLDER_3-POLE: 9210-0086 BC6033PQ Fuseholder, Class CC & Class G, 3 pole, 600V, 30A, for 13/32x1 1/2 fuses Cooper/Bussman North Coast Electric
HALL = SOSI-Wiring-Diagram.rpt:DRUM_SENSOR
JOYSTICK = SOSI-Wiring-Diagram.rpt:JOYSTICK
LAMP1 = DougM-SOSI-Wiring-Diagram.rpt:INDICATOR_LIGHT: 9210-0341 OMPBD7D-P3N3 Indicator Light, LED, Complete Asssembly, 22.5mm, IP66, 24V AC/DC Omega www.omega.com
PS1 = DougM-SOSI-Wiring-Diagram.rpt:DC-DC_CONVERTER_VGS-50-12
PS2 = DougM-SOSI-Wiring-Diagram.rpt:DC-DC_CONVERTER_24V-5V
R1 R3 = resistor:R-US_: RESISTOR, American symbol
R2 = DougM-SOSI-ResCap:RESISTOR: Resistor Basic schematic elements and footprints for 0603, 1206, and PTH resistors.
RADIO1 = DougM-SOSI-Wiring-Diagram.rpt:SPARKFUN_XBEE_EXPLORER_SERIAL
RELAY1 RELAY2 = DougM-SOSI-Wiring-Diagram.rpt:RELAY_TB
REMOTE SPEED = DougM-SOSI-Wiring-Diagram.rpt:SWITCH_DPDT: 9210-0123 Switch, Non-Illuminated, 30.5mm, Type 4/4x/13, 2 Pos. Selector, Std. Knob Maint, 1 N.O.-1 N.C., WHITE 9210-0175?? Switch, Selector, 2-Position, Maintained, Blk handle w/ wht insert (old #800H-24HRAH2KB6AX)
RESET = DougM-SOSI-Wiring-Diagram.rpt:SWITCH_MOM_NO: 9210-0072 Mouser Part #: 850-59-313 Manufacturer Part #: 59-313
RS232 = SOSI-Wiring-Diagram.rpt:RS232-RS485_CONVERTER
U$1 U$2 U$4 U$7 U$8 U$16-U$35 = SOSI-TerminalBlocks:TB_3031160_1POS
U$3 = DougM-SOSI-Wiring-Diagram.rpt:SWITCH_ESTOP_LIGHTED: 9210-0045 Switch, Emergency Stop, w/ #800T-XA4 contact block (old #800H-FRXTQH10RA4) Allen Bradley 800H-FRXTQH2RA4
U$5 = SOSI-Wiring-Diagram.rpt:THERMISTOR: (no PN available) (no description available) Soundnine Inc. (no vendor PN available)
U$6 = SOSI-Wiring-Diagram.rpt:FUSE_HOLDER_2-POLE: 9210-0047 Cooper/Bussman BM6032SQ 9210-0194 Cooper/Bussman BK/S-8301-2-R
U$9 U$10 = SOSI-TerminalBlocks:TB_FUSE_DDFL4ULR
U$11 = SOSI-Wiring-Diagram.rpt:MOTOR_3PH: 9500-0000 113020 Electric motor, washdown, 1HP, 208-230/460VAC, 3 phase, 1725 RPM, 56C mounting 9500-0005 G120762 Electric Motor, Washdown, 2HP, 208-230/460V, 60Hz, Cont., 1800 RPM, TEFC, 145TC 9500-0007 CEWDBM3611T BrakeMotor, Electric, Washdown, 3HP, 208-230/460V, 1760RPM, 3 Ph., 60Hz, 182TC, TEFC 9500-0009 G140467.00 Electric Motor, Washdown, 7.5HP, 220 VAC, 50-60 Hz, 3 Phase, 213TC Frame, No Base Leeson Kaman Industrial Technologies McGuire Bearing
VFD1 = Inverters:HITACHI_WJ200-075LF
VFD2 = Inverters:HITACHI_HBU-2030